# EasyEDA Pro project ProPrj_HTC_Controller.epro

# Schematic HTC_Controller
Board Name: Board1; Create Date: 2024-06-29; Page Name: P1; Project Name: HTC_Controller; Schematic Name: HTC_Controller; Update Date: 2025-04-29; Drawed: 松鼠; Page Size: A4; Version: V1.0
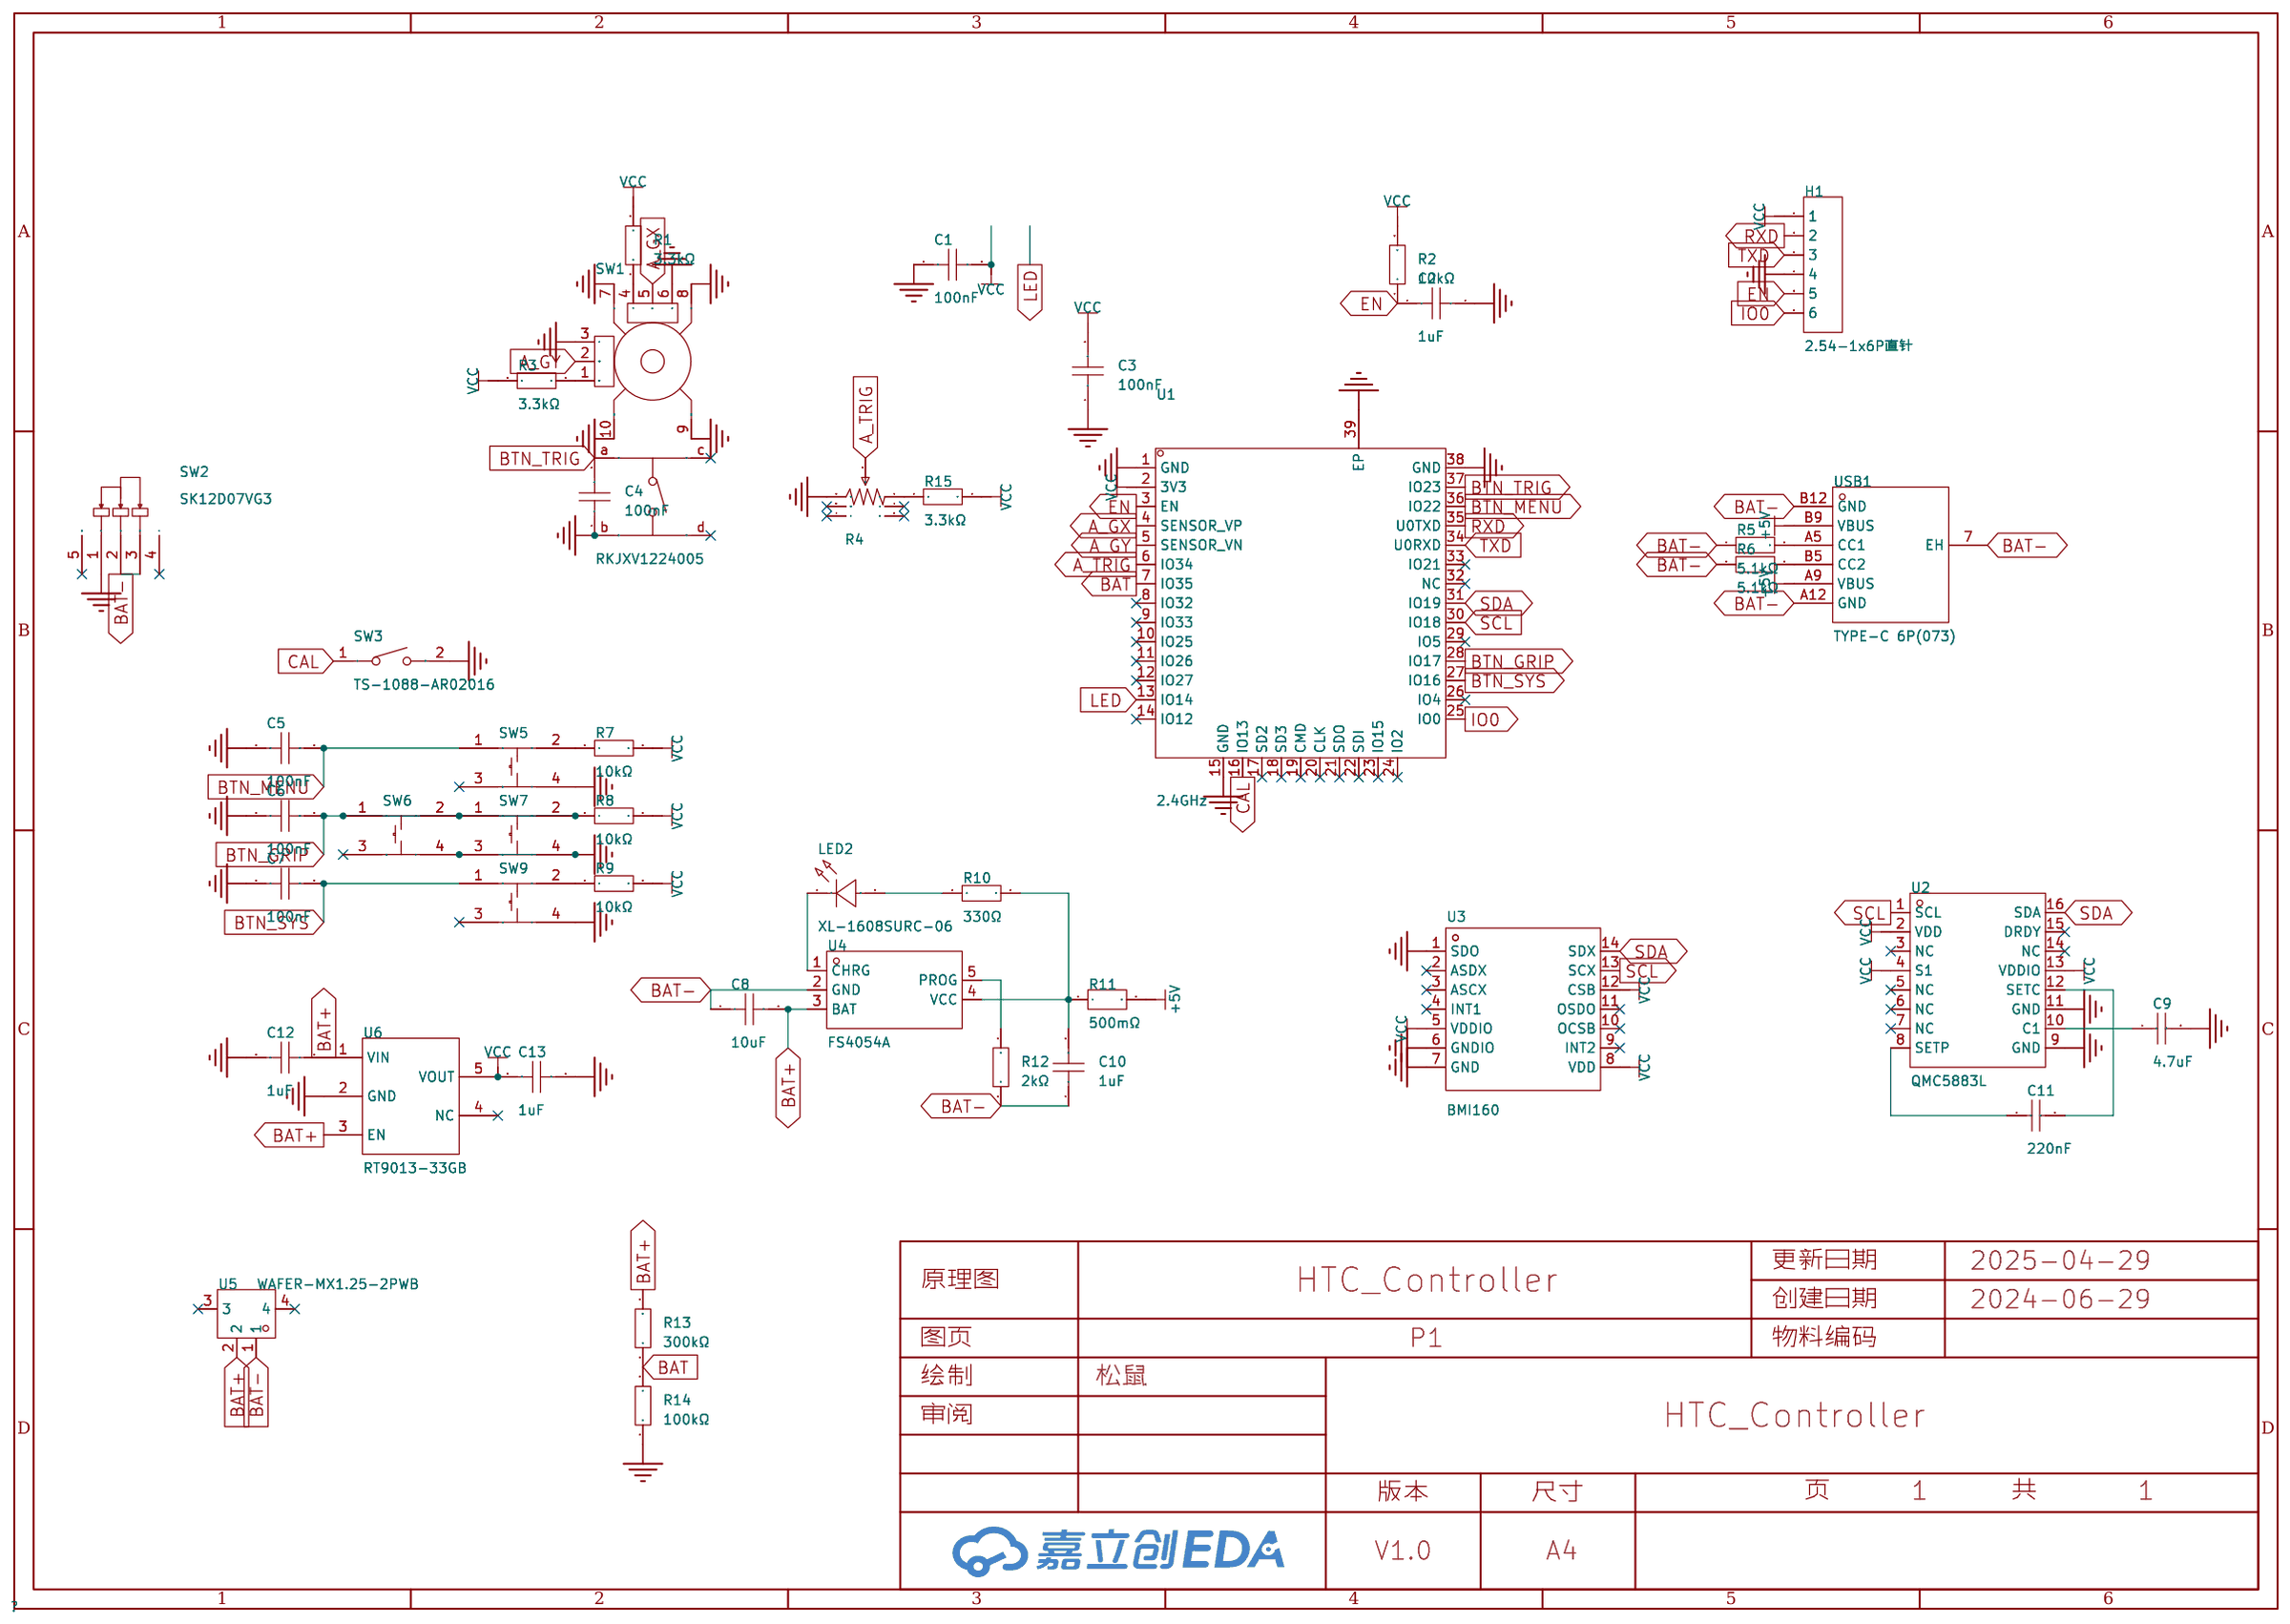
[diagram p0: schematic sheet]

## Parts
C1  100nF  [C0603]
C2  1uF  [C0603]
C3  100nF  [C0603]
C4  100nF  [C0603]
C5  100nF  [C0603]
C6  100nF  [C0603]
C7  100nF  [C0603]
C8  10uF  [C0603]
C9  4.7uF  [C0603]
C10  1uF  [C0603]
C11  220nF  [C0603]
C12  1uF  [C0603]
C13  1uF  [C0603]
H1  2.54-1x6P直针  [HDR-TH_6P-P2.54-V-M-1]
LED2  XL-1608SURC-06  [LED0603-RD_RED]
R1  3.3kΩ  [R0603]
R2  10kΩ  [R0603]
R3  3.3kΩ  [R0603]
R4  Y16-YZL7.2-B5Kb(55)-G-C01  [RES-ADJ-TH_Y16-YZL7.2-B5KB55-G-C01]
R5  5.1kΩ  [R0603]
R6  5.1kΩ  [R0603]
R7  10kΩ  [R0603]
R8  10kΩ  [R0603]
R9  10kΩ  [R0603]
R10  330Ω  [R0603]
R11  500mΩ  [R1210]
R12  2kΩ  [R0603]
R13  300kΩ  [R0603]
R14  100kΩ  [R0603]
R15  3.3kΩ  [R0603]
SW1  RKJXV1224005  [SW-TH_RKJXV1224005]
SW2  SK12D07VG3  [SW-TH_SK12D07VG3]
SW3  TS-1088-AR02016  [SW-SMD_L3.9-W3.0-P4.45]
SW5  TS-1003S-05026  [KEY-SMD_4P-L12.0-W12.0-P5.00-LS15.2]
SW6  TS-1003S-05026  [KEY-SMD_4P-L12.0-W12.0-P5.00-LS15.2]
SW7  TS-1003S-05026  [KEY-SMD_4P-L12.0-W12.0-P5.00-LS15.2]
SW9  TS-1003S-05026  [KEY-SMD_4P-L12.0-W12.0-P5.00-LS15.2]
U1  2.4GHz  [WIRELM-SMD_ESP32-S]
U2  QMC5883L  [LGA-16_L3.0-W3.0-P0.50-BL_SQ]
U3  BMI160  [LGA-14_L3.0-W2.5-P0.50-BL]
U4  FS4054A  [SOT-23-5_L2.9-W1.6-P0.95-LS2.8-BL]
U5  WAFER-MX1.25-2PWB  [CONN-SMD_2P-P1.25_XUNPU_WAFER-MX1.25-2PWB]
U6  RT9013-33GB  [SOT-23-5_L3.0-W1.7-P0.95-LS2.8-BL]
USB1  TYPE-C 6P(073)  [TYPE-C-SMD_TYPE-C-6P_5]

## Library data of the parts
C1 C3-C7 = CC0603KRX7R9BB104: 容值:100nF;精度:±10%;额定电压:50V;材质(温度系数):X7R;; LCSC Part Name: 100nF ±10% 50V; Supplier Part: C14663; Manufacturer: YAGEO(国巨); Supplier Footprint: 0603; JLCPCB Part Class: 基础库; Datasheet: https://atta.szlcsc.com/upload/public/pdf/source/20170116/1484561234239.pdf; Supplier: LCSC; Tolerance: ±10%; Voltage Rated: 50V; Temperature Coefficient: X7R
C2 = CL10A105KB8NNNC: 容值:1uF;精度:±10%;额定电压:50V;材质(温度系数):X5R;; LCSC Part Name: 1uF ±10% 50V; Supplier Part: C15849; Manufacturer: SAMSUNG(三星); Supplier Footprint: 0603; JLCPCB Part Class: 基础库; Datasheet: https://atta.szlcsc.com/upload/public/pdf/source/20160218/1457707763339.pdf; Supplier: LCSC; Tolerance: ±10%; Voltage Rated: 50V; Temperature Coefficient: X5R
C8 = CGA0603X5R106K100JT: 容值:10uF;精度:±10%;额定电压:10V;材质(温度系数):X5R;; LCSC Part Name: 10uF ±10% 10V; Supplier Part: C6119842; Manufacturer: HRE(芯声); Supplier Footprint: 0603; JLCPCB Part Class: 扩展库; Supplier: LCSC; Tolerance: ±10%; Voltage Rated: 10V; Temperature Coefficient: X5R
C9 = CL10A475KO8NNNC: 容值:4.7uF;精度:±10%;额定电压:16V;材质(温度系数):X5R;; LCSC Part Name: 4.7uF ±10% 16V; Supplier Part: C19666; Manufacturer: SAMSUNG(三星); Supplier Footprint: 0603; JLCPCB Part Class: 基础库; Datasheet: https://atta.szlcsc.com/upload/public/pdf/source/20160218/1457707763339.pdf; Supplier: LCSC; Tolerance: ±10%; Voltage Rated: 16V; Temperature Coefficient: X5R
C10 = CGA0603X5R105K160JT: 容值:1uF;精度:±10%;额定电压:16V;材质(温度系数):X5R;; LCSC Part Name: 1uF ±10% 16V; Supplier Part: C6119849; Manufacturer: HRE(芯声); Supplier Footprint: 0603; JLCPCB Part Class: 扩展库; Supplier: LCSC; Tolerance: ±10%; Voltage Rated: 16V; Temperature Coefficient: X5R
C11 = CL10B224KA8NNNC: 容值:220nF;精度:±10%;额定电压:25V;材质(温度系数):X7R;; LCSC Part Name: 220nF ±10% 25V; Supplier Part: C21120; Manufacturer: SAMSUNG(三星); Supplier Footprint: 0603; JLCPCB Part Class: 基础库; Datasheet: https://atta.szlcsc.com/upload/public/pdf/source/20160218/1457707763339.pdf; Supplier: LCSC; Tolerance: ±10%; Voltage Rated: 25V; Temperature Coefficient: X7R
C12 C13 = CGA0603X5R105K500JT: 容值:1uF;精度:±10%;额定电压:50V;温度系数:X5R;; LCSC Part Name: 1uF ±10% 50V; Supplier Part: C6119852; Manufacturer: HRE(芯声); Supplier Footprint: 0603; JLCPCB Part Class: 扩展库; Supplier: LCSC; Tolerance: ±10%; Voltage Rating: 50V; Temperature Coefficient: X5R
H1 = 2.54-1x6P直针: 插针结构:1x6P;间距:2.54mm;行距:-;圆针/方针:方针;安装方式:直插;排数:单排;总PIN位数:6P;额定电流:3A;额定电压:-;配合针长度:-;塑高:-;触头材质:黄铜;触头镀层:-;工作温度:-40℃~+105℃;颜色:黑色;; LCSC Part Name: 1x6P 间距:2.54mm 方针 直插; Supplier Part: C37208; Manufacturer: BOOMELE(博穆精密); Supplier Footprint: 插件,P=2.54mm; JLCPCB Part Class: 扩展库; Datasheet: https://atta.szlcsc.com/upload/public/pdf/source/20250115/42A019761A40C8B839643401D8CA5A96.pdf; Supplier: LCSC; Pin Structure: 1x6P; Pitch: 2.54mm; Circluar Pins/Square Pins: 方针; Mounting Type: 直插; Number of Rows: 单排; Number of Pins: 6P; Current Rating: 3A; Contact Material: 黄铜; Operating Temperature: -40℃~+105℃; Color: 黑色
LED2 = XL-1608SURC-06: 发光颜色:红色;功率:55mW;正向电流:25mA;主波长:617nm~621nm;透镜颜色:无色透明透镜;色温:-;发光角度:120°;载带方式:正贴;工作温度:-30℃~+85℃;; Supplier Part: C965799; Manufacturer: XINGLIGHT(成兴光); Supplier Footprint: 0603; JLCPCB Part Class: 扩展库; Datasheet: https://atta.szlcsc.com/upload/public/pdf/source/20221102/D860AFDD1CDB02C5A8064103A32707E2.pdf; Supplier: LCSC; Emitted Color: 红色; Power Dissipation: 55mW; Forward Current: 25mA; Dominant Wavelength: 617nm~621nm; Peak Wavelength: 623nm; Lens Color: 无色透明透镜; Viewing Angle: 120°; Mounting Sytle: 正贴; Operating Temperature: -30℃~+85℃
R1 R3 R15 = 0603WAF3301T5E: 电阻类型:厚膜电阻;阻值:3.3kΩ;精度:±1%;功率:100mW;最大工作电压:75V;温度系数:±100ppm/℃;; LCSC Part Name: 3.3kΩ ±1% 100mW 厚膜电阻; Supplier Part: C22978; Manufacturer: UNI-ROYAL(厚声); Supplier Footprint: 0603; JLCPCB Part Class: 基础库; Datasheet: https://atta.szlcsc.com/upload/public/pdf/source/20200306/C422600_1E6D84923E4A46A82E41ADD87F860B5C.pdf; Supplier: LCSC; Type: 厚膜电阻; Tolerance: ±1%; Power(Watts): 100mW; Overload Voltage (Max): 75V; Temperature Coefficient: ±100ppm/℃; Operating Temperature Range: -55℃~+155℃
R2 R7-R9 = 0603WAF1002T5E: 电阻类型:厚膜电阻;阻值:10kΩ;精度:±1%;功率:100mW;最大工作电压:75V;温度系数:±100ppm/℃;; LCSC Part Name: 厚膜电阻 10kΩ ±1% 100mW; Supplier Part: C25804; Manufacturer: UNI-ROYAL(厚声); Supplier Footprint: 0603; JLCPCB Part Class: 基础库; Datasheet: https://atta.szlcsc.com/upload/public/pdf/source/20200306/C422600_1E6D84923E4A46A82E41ADD87F860B5C.pdf; Supplier: LCSC; Type: 厚膜电阻; Tolerance: ±1%; Power(Watts): 100mW; Overload Voltage (Max): 75V; Temperature Coefficient: ±100ppm/℃; Operating Temperature Range: -55℃~+155℃
R4 = Y16-YZL7.2-B5Kb(55)-G-C01: 摇杆电位器、操纵杆电位器，适用于航模玩具遥控器电位器、3D摇杆PS4手柄游戏机、无人机摇杆电位器、VR摇杆电位器、工业控制器; Supplier Part: C37323743; Manufacturer: YTL(亚特联); Supplier Footprint: 插件-7P,19.8x15.5mm; JLCPCB Part Class: 扩展库; Datasheet: https://atta.szlcsc.com/upload/public/pdf/source/20240806/CE5C57122514D828D960FC3B4F94AB1F.pdf; Supplier: LCSC
R5 R6 = 0603WAF5101T5E: 电阻类型:厚膜电阻;阻值:5.1kΩ;精度:±1%;功率:100mW;最大工作电压:75V;温度系数:±100ppm/℃;; LCSC Part Name: 5.1kΩ ±1% 100mW 厚膜电阻; Supplier Part: C23186; Manufacturer: UNI-ROYAL(厚声); Supplier Footprint: 0603; JLCPCB Part Class: 基础库; Datasheet: https://atta.szlcsc.com/upload/public/pdf/source/20200306/C422600_1E6D84923E4A46A82E41ADD87F860B5C.pdf; Supplier: LCSC; Type: 厚膜电阻; Tolerance: ±1%; Power(Watts): 100mW; Overload Voltage (Max): 75V; Temperature Coefficient: ±100ppm/℃; Operating Temperature Range: -55℃~+155℃
R10 = 0603WAF3300T5E: 电阻类型:厚膜电阻;阻值:330Ω;精度:±1%;功率:100mW;最大工作电压:75V;温度系数:±100ppm/℃;; LCSC Part Name: 330Ω ±1% 100mW 厚膜电阻; Supplier Part: C23138; Manufacturer: UNI-ROYAL(厚声); Supplier Footprint: 0603; JLCPCB Part Class: 基础库; Datasheet: https://atta.szlcsc.com/upload/public/pdf/source/20200306/C422600_1E6D84923E4A46A82E41ADD87F860B5C.pdf; Supplier: LCSC; Type: 厚膜电阻; Tolerance: ±1%; Power(Watts): 100mW; Overload Voltage (Max): 75V; Temperature Coefficient: ±100ppm/℃; Operating Temperature Range: -55℃~+155℃
R11 = FRL1210FR500TS: 电阻类型:厚膜电阻;阻值:500mΩ;精度:±1%;功率:500mW;最大工作电压:500V;温度系数:±200ppm/℃;; LCSC Part Name: 厚膜电阻 500mΩ ±1% 500mW; Supplier Part: C2960668; Manufacturer: FOJAN(富捷); Supplier Footprint: 1210; JLCPCB Part Class: 扩展库; Datasheet: https://atta.szlcsc.com/upload/public/pdf/source/20211221/925EC7D7225764EE0046F22065062C87.pdf; Supplier: LCSC; Type: 厚膜电阻; Tolerance: ±1%; Power(Watts): 500mW; Overload Voltage (Max): 500V; Temperature Coefficient: ±200ppm/℃; Operating Temperature Range: -55℃~+155℃
R12 = 0603WAF2001T5E: 电阻类型:厚膜电阻;阻值:2kΩ;精度:±1%;功率:100mW;最大工作电压:75V;温度系数:±100ppm/℃;; LCSC Part Name: 2kΩ ±1% 100mW 厚膜电阻; Supplier Part: C22975; Manufacturer: UNI-ROYAL(厚声); Supplier Footprint: 0603; JLCPCB Part Class: 基础库; Datasheet: https://atta.szlcsc.com/upload/public/pdf/source/20200306/C422600_1E6D84923E4A46A82E41ADD87F860B5C.pdf; Supplier: LCSC; Type: 厚膜电阻; Tolerance: ±1%; Power(Watts): 100mW; Overload Voltage (Max): 75V; Temperature Coefficient: ±100ppm/℃; Operating Temperature Range: -55℃~+155℃
R13 = 0603WAF3003T5E: 电阻类型:厚膜电阻;阻值:300kΩ;精度:±1%;功率:100mW;最大工作电压:75V;温度系数:±100ppm/℃;; LCSC Part Name: 300kΩ ±1% 100mW 厚膜电阻; Supplier Part: C23024; Manufacturer: UNI-ROYAL(厚声); Supplier Footprint: 0603; JLCPCB Part Class: 基础库; Datasheet: https://atta.szlcsc.com/upload/public/pdf/source/20200306/C422600_1E6D84923E4A46A82E41ADD87F860B5C.pdf; Supplier: LCSC; Type: 厚膜电阻; Tolerance: ±1%; Power(Watts): 100mW; Overload Voltage (Max): 75V; Temperature Coefficient: ±100ppm/℃; Operating Temperature Range: -55℃~+155℃
R14 = 0603WAF1003T5E: 电阻类型:厚膜电阻;阻值:100kΩ;精度:±1%;功率:100mW;最大工作电压:75V;温度系数:±100ppm/℃;; LCSC Part Name: 100kΩ ±1% 100mW 厚膜电阻; Supplier Part: C25803; Manufacturer: UNI-ROYAL(厚声); Supplier Footprint: 0603; JLCPCB Part Class: Basic Part; Datasheet: https://atta.szlcsc.com/upload/public/pdf/source/20200306/C422600_1E6D84923E4A46A82E41ADD87F860B5C.pdf; Supplier: LCSC; Type: 厚膜电阻; Tolerance: ±1%; Power(Watts): 100mW; Overload Voltage (Max): 75V; Temperature Coefficient: ±100ppm/℃; Operating Temperature Range: -55℃~+155℃
SW1 = RKJXV1224005: 操纵杆复位 中央按动开关 适用于航模玩具遥控器电位器、3D摇杆PS4手柄游戏机、无人机摇杆电位器、工业控制器; Supplier Part: C146170; Manufacturer: ALPSALPINE(阿尔卑斯阿尔派); Supplier Footprint: 插件,13x13mm; JLCPCB Part Class: 扩展库; Datasheet: https://atta.szlcsc.com/upload/public/pdf/source/20180125/C146170_15168615510911301620.pdf; Supplier: LCSC
SW2 = SK12D07VG3: 电路结构:单刀双掷;安装方式:侧插;开关颜色:-;额定电流(DC):500mA;额定电压(DC):50V;额定电流(AC):-;额定电压(AC):-;机械寿命:5千次;; LCSC Part Name: 两档位卧式拨动开关,柄长3MM; Supplier Part: C431547; Manufacturer: SHOU HAN(首韩); Supplier Footprint: 插件; JLCPCB Part Class: 扩展库; Datasheet: https://atta.szlcsc.com/upload/public/pdf/source/20190925/C431547_01B93C6F3FA5C09E15F8CCBF4E6DB91A.pdf; Supplier: LCSC; Circuit: 单刀双掷; Pin Style: PC引脚; Switch Length: 8.7mm; Switch Width: 4.4mm; Switch Height: 4.7mm; Mounting Style: 侧插; Current Rating (DC): 500mA; Voltage Rating (DC): 50V; Mechanical Life: 5千次; Operating Temperature: -10℃~+50℃
SW3 = TS-1088-AR02016: 电路结构:单刀单掷;按钮形状:圆形按钮;作用力:160gf;安装方式:立贴;开关长度:4mm;开关宽度:3mm;开关高度:2mm;带支架:不带;触点电流:50mA;额定电压(DC):12V;绝缘电阻:100MΩ;机械寿命:10万次;; LCSC Part Name: 4*3*2mm 立贴 轻触开关; Supplier Part: C720477; Manufacturer: XUNPU(讯普); Supplier Footprint: SMD; JLCPCB Part Class: 扩展库; Datasheet: https://atta.szlcsc.com/upload/public/pdf/source/20200810/C720475_60D09DD6C54279ADDB2DC25100F1CC11.pdf; Supplier: LCSC; Circuit: 单刀单掷; Actuator Style: 圆形按钮; Operating Force: 160gf; Mounting Style: 立贴; Switch Length: 4mm; Switch Width: 3mm; Switch Height: 2mm; Strike Gundam: 不带; Contact Current: 50mA; Voltage Rating (DC): 12V; Insulation Resistance: 100MΩ; Actuator/Cap Color: 黑色; Pin Style: SMD接片; Mechanical Life: 10万次; Operating Temperature: -30℃~+80℃
SW5-SW7 SW9 = TS-1003S-05026: 电路结构:单刀单掷;按钮形状:圆形按钮;安装方式:立贴;开关长度:12mm;开关宽度:12mm;开关高度:5mm;触点电流:50mA;额定电压(DC):12V;带灯:-;机械寿命:-;; LCSC Part Name: 12*12*5mm 立贴 轻触开关; Supplier Part: C455219; Manufacturer: XUNPU(讯普); Supplier Footprint: SMD,12x12mm; JLCPCB Part Class: 扩展库; Datasheet: https://atta.szlcsc.com/upload/public/pdf/source/20191118/C455233_8350A2262BDF54A6D5D6E1D36705B166.pdf; Supplier: LCSC; Circuit: 单刀单掷; Actuator Style: 圆形按钮; Mounting Style: 立贴; Switch Length: 12mm; Switch Width: 12mm; Switch Height: 5mm; Contact Current: 50mA; Voltage Rating (DC): 12V
U1 = ESP32-S: 核心处理器:ESP32芯片;频率:2.4GHz;天线形式:IPEX接口;发射功率:17dBm;接收灵敏度:-90dBm;; Supplier Part: C277944; Manufacturer: Ai-Thinker(安信可); Supplier Footprint: SMD; JLCPCB Part Class: 扩展库; Datasheet: https://atta.szlcsc.com/upload/public/pdf/source/20211217/F4BEA33E732D6002D10DAED85BBCB52B.pdf; Supplier: LCSC; Core Processor: ESP32芯片; Support Interface: I2C；UART；DAC；SPI；PWM；ADC; Antenna Type: IPEX接口; Output Power: 17dBm; Operating Voltage: 3.3V; Sensitivity: -90dBm; Operating Temperature: -40℃~+85℃
U2 = QMC5883L: LCSC Part Name: 三轴磁传感器; Supplier Part: C976032; Manufacturer: QST(上海矽睿); Supplier Footprint: LGA-16(3x3); JLCPCB Part Class: 扩展库; Datasheet: https://atta.szlcsc.com/upload/public/pdf/source/20201217/C976032_5B9A2F3901E175046CBA037B1F18A1F2.pdf; Supplier: LCSC
U3 = BMI160: 传感器类型:-;轴向:-;接口类型:-;; Supplier Part: C94021; Manufacturer: Bosch(博世); Supplier Footprint: LGA-14(2.5x3); JLCPCB Part Class: 扩展库; Datasheet: https://atta.szlcsc.com/upload/public/pdf/source/20170818/C94021_1503051343757895423.pdf; Supplier: LCSC; Operating Temperature: -40℃~+85℃
U4 = FS4054A: LCSC Part Name: 电池管理; Supplier Part: C2936840; Manufacturer: FOSAN(富信); Supplier Footprint: SOT-23-5L; JLCPCB Part Class: 扩展库; Datasheet: https://atta.szlcsc.com/upload/public/pdf/source/20211228/BC9C32D45588DB82BD95EABB7A26746D.pdf; Supplier: LCSC
U5 = WAFER-MX1.25-2PWB: 插针结构:1x2P;间距:1.25mm;安装方式:卧贴;总PIN数:2P;排数:1;每排PIN数:2;额定电流:1A;工作温度范围:-25℃~+85℃;; LCSC Part Name: 1x2P 间距:1.25mm 卧贴; Supplier Part: C3029359; Manufacturer: XUNPU(讯普); Supplier Footprint: SMD,P=1.25mm,卧贴; JLCPCB Part Class: 扩展库; Datasheet: https://atta.szlcsc.com/upload/public/pdf/source/20220527/5ACBB683E384B6AD06743F272F933620.pdf; Supplier: LCSC; Pins Structure: 1x2P; Pitch: 1.25mm; Mounting Style: 卧贴; Number of Pins: 2P; Number of Rows: 1; Number of PINs Per Row: 2; Current Rating (Max): 1A; Operating Temperature Range: -25℃~+85℃
U6 = RT9013-33GB: 输出类型:固定;最大输入电压:5.5V;输出电压:3.3V;输出电流:500mA;电源纹波抑制比(PSRR):50dB@(10kHz);输出极性:正极;; LCSC Part Name: 输入5.5V 输出3.3V 500mA; Supplier Part: C47773; Manufacturer: RICHTEK(立锜); Supplier Footprint: SOT-23-5; JLCPCB Part Class: 扩展库; Datasheet: https://atta.szlcsc.com/upload/public/pdf/source/20150504/1457707282459.pdf; Supplier: LCSC; Output Type: 固定; Maximum Input Voltage: 5.5V; Output Voltage: 3.3V; Output Current: 500mA; Power Supply Rejection Ratio (PSRR): 50dB@(10kHz); Dropout Voltage: 400mV@(500mA); standby current: 50uA; Feature: 低ESR；防静电保护；热保护(TSD)；过流保护(OCP)；带使能; Operating Temperature: -40℃~+85℃; Output Polarity: 正极; Number of Outputs: 1
USB1 = TYPE-C 6P(073): 连接器类型:Type-C;标准:USB 3.1;公母:母;安装方式:卧贴;触点数量:6P;端口数量:1;额定电流 - 电源:3A;工作温度范围:-25℃~+85℃;; LCSC Part Name: Type-C 母 卧贴; Supplier Part: C668623; Manufacturer: SHOU HAN(首韩); Supplier Footprint: SMD; JLCPCB Part Class: 扩展库; Datasheet: https://atta.szlcsc.com/upload/public/pdf/source/20200618/C668623_A4B260DED7AC1949BAC6AE39E9F4CD80.pdf; Supplier: LCSC; Connector Type: Type-C; Standard: USB 3.1; Gender: 母; Mounting Style: 卧贴; Number of Contacts: 6P; Number of Ports: 1; Current Rating - Power (Max): 3A; Operating Temperature Range: -25℃~+85℃; Rated Voltage (Max): 5V; Connect-Disconnect Life: 1万次; Core Colour: 黑色

## Nets
+5V: R11.2 USB1.A9(VBUS) USB1.B9(VBUS)
GND: C1.1 C2.2 C3.1 C4.1 C5.1 C6.1 C7.1 C9.2 C12.2 C13.1 H1.4 R4.3 R14.1 SW1.3(A) SW1.6(B) SW1.7(GND) SW1.8(GND) SW1.9(GND) SW1.10(GND) SW1.b SW2.1 SW3.2 SW5.4 SW6.4 SW7.3 SW7.4 SW9.4 U1.1(GND) U1.15(GND) U1.38(GND) U1.39(EP) U2.9(GND) U2.11(GND) U3.1(SDO) U3.6(GNDIO) U3.7(GND) U6.2(GND)
VCC: C1.2 C3.2 C13.2 H1.1 R1.2 R2.2 R3.1 R7.2 R8.2 R9.2 R15.2 U1.2(3V3) U2.2(VDD) U2.4(S1) U2.13(VDDIO) U3.5(VDDIO) U3.8(VDD) U3.12(CSB) U6.5(VOUT)
A_GX: SW1.5(DTA) U1.4(SENSOR_VP)
A_GY: SW1.2(DTA) U1.5(SENSOR_VN)
A_TRIG: R4.2 U1.6(IO34)
BAT: R13.1 R14.2 U1.7(IO35)
BAT+: C8.2 C12.1 R13.2 U4.3(BAT) U5.2 U6.1(VIN) U6.3(EN)
BAT-: C8.1 C10.1 R5.1 R6.1 R12.2 SW2.2 SW2.3 U4.2(GND) U5.1 USB1.7(EH) USB1.A12(GND) USB1.B12(GND)
BTN_GRIP: C6.2 R8.1 SW6.1 SW6.2 SW7.1 SW7.2 U1.28(IO17)
BTN_MENU: C5.2 SW5.1 U1.36(IO22)
BTN_SYS: C7.2 SW9.1 U1.27(IO16)
BTN_TRIG: C4.2 SW1.a U1.37(IO23)
CAL: SW3.1 U1.16(IO13)
EN: C2.1 H1.5 R2.1 U1.3(EN)
IO0: H1.6 U1.25(IO0)
LED: U1.13(IO14)
RXD: H1.2 U1.35(U0TXD)
SCL: U1.30(IO18) U2.1(SCL) U3.13(SCX)
SDA: U1.31(IO19) U2.16(SDA) U3.14(SDX)
TXD: H1.3 U1.34(U0RXD)
$1N14743: LED2.2(A) R10.2
$1N14744: LED2.1(K) U4.1(CHRG)
$1N14746: R12.1 U4.5(PROG)
$1N14747: C10.2 R10.1 R11.1 U4.4(VCC)
$1N15140: C11.2 U2.12(SETC)
$1N15141: C11.1 U2.8(SETP)
$1N15144: C9.1 U2.10(C1)
$1N15837: R6.2 USB1.B5(CC2)
$1N15838: R5.2 USB1.A5(CC1)
$1N20609: R3.2 SW1.1(B)
$1N20611: R1.1 SW1.4(A)
$1N24568: R9.1 SW9.2
$1N24570: R7.1 SW5.2
$1N30109: R4.1 R15.1

Not connected (* = marked no-connect by the designer): R4 4* 5* 6* 7*; SW1 c* d*; SW2 4* 5*; SW5 3*; SW6 3*; SW9 3*; U1 8(IO32)* 9(IO33)* 10(IO25)* 11(IO26)* 12(IO27)* 14(IO12)* 17(SD2)* 18(SD3)* 19(CMD)* 20(CLK)* 21(SDO)* 22(SDI)* 23(IO15)* 24(IO2)* 26(IO4)* 29(IO5)* 32(NC)* 33(IO21)*; U2 3(NC)* 5(NC)* 6(NC)* 7(NC)* 14(NC)* 15(DRDY)*; U3 2(ASDX)* 3(ASCX)* 4(INT1)* 9(INT2)* 10(OCSB)* 11(OSDO)*; U5 3* 4*; U6 4(NC)*

# Schematic HTC_Controller_1
Board Name: Board1_1; Create Date: 2025-04-28; Page Name: P1; Project Name: HTC_Controller; Schematic Name: HTC_Controller_1; Update Date: 2025-04-28; Drawed: 松鼠; Page Size: A4; Version: V1.0
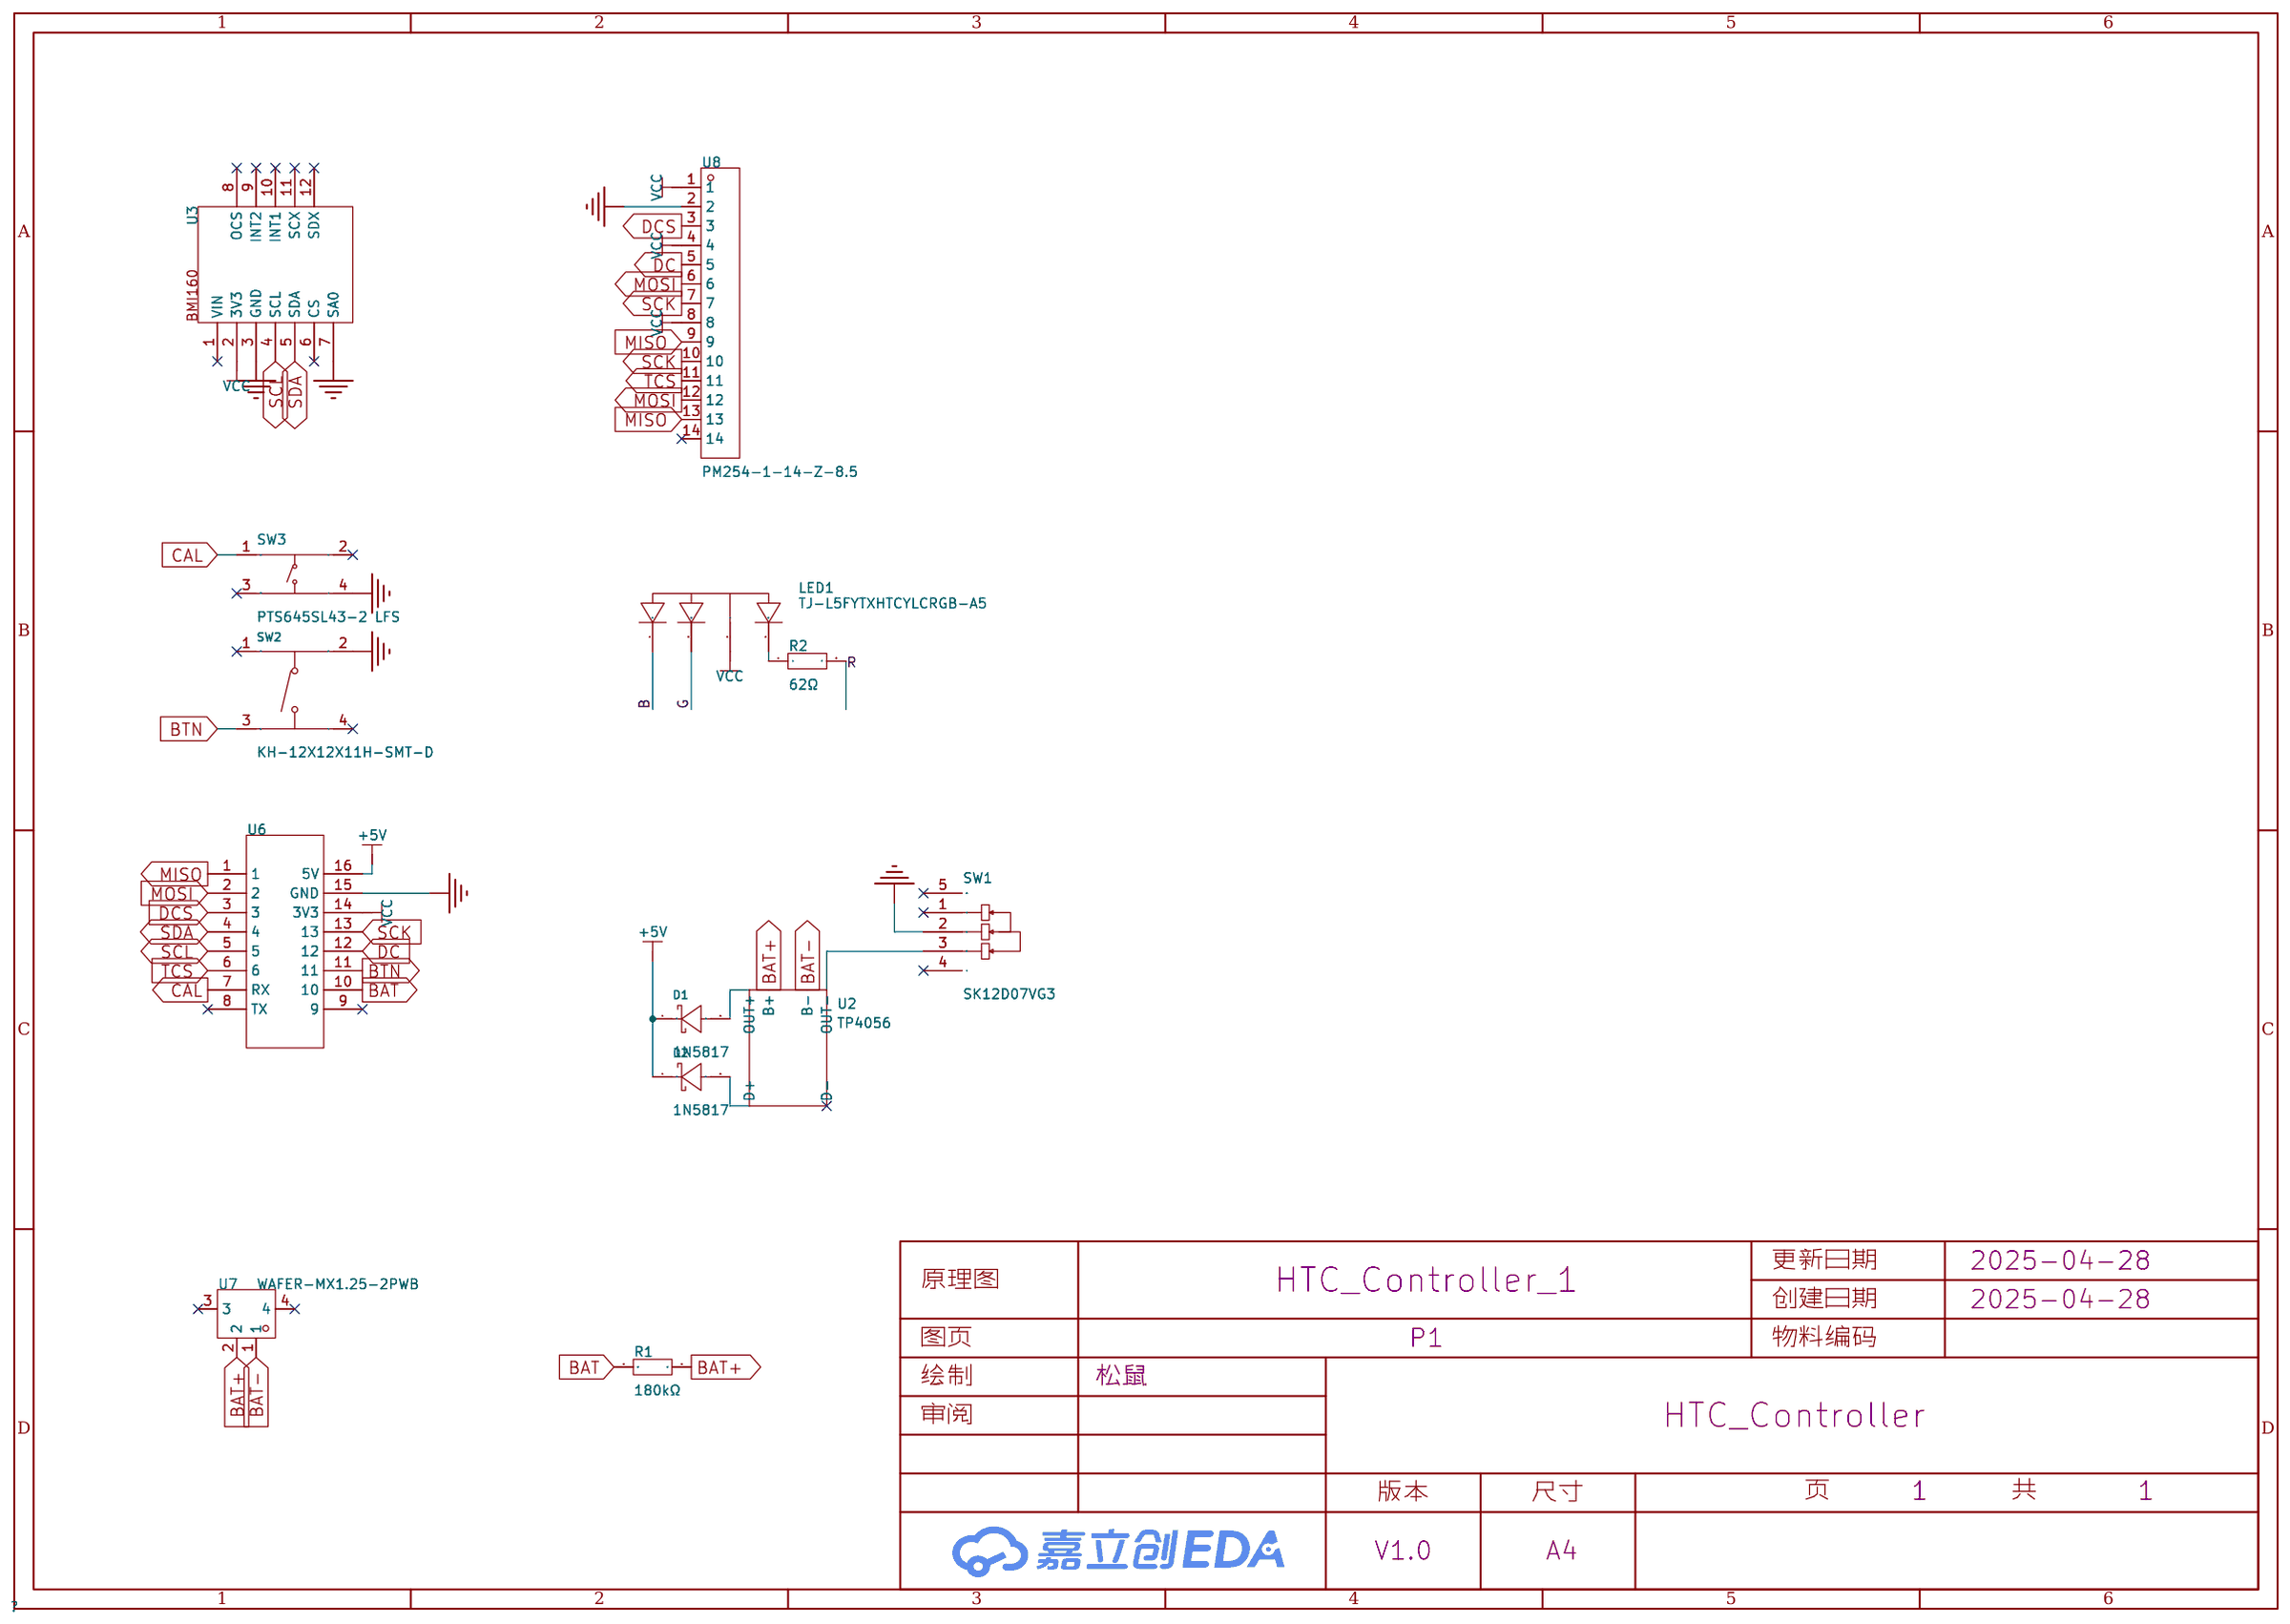
[diagram p1: schematic sheet]

## Parts
D1  1N5817  [DO-41_BD2.4-L4.7-P8.70-D0.9-RD]
D2  1N5817  [DO-41_BD2.4-L4.7-P8.70-D0.9-RD]
LED1  TJ-L5FYTXHTCYLCRGB-A5  [LED-TH_4P-BD5.8-P1.30]
R1  180kΩ  [RES-TH_BD2.2-L6.5-P10.50-D0.6]
R2  62Ω  [RES-TH_BD2.2-L6.5-P10.50-D0.6]
SW1  SK12D07VG3  [SW-TH_SK12D07VG3]
SW2  KH-12X12X11H-SMT-D  [SW-SMD_4P-L12.0-W12.0-P5.00-LS15.2]
SW3  PTS645SL43-2 LFS  [KEY-TH_4P-L6.0-W6.0-P4.50-LS6.50]
U2  TP4056  [TP4056]
U3  -  [BMI160]
U6  -  [【封装Supermini】]
U7  WAFER-MX1.25-2PWB  [CONN-SMD_2P-P1.25_XUNPU_WAFER-MX1.25-2PWB]
U8  PM254-1-14-Z-8.5  [HDR-TH_14P-P2.54-V-F-1]

## Library data of the parts
D1 D2 = 1N5817_C698892: 正向压降(Vf):450mV@1A;直流反向耐压(Vr):20V;平均整流电流(Io):1A;; LCSC Part Name: 电压:20V 电流:1A; Supplier Part: C698892; Manufacturer: YANGJIE(扬杰); Supplier Footprint: DO-41; JLCPCB Part Class: 扩展库; Datasheet: https://atta.szlcsc.com/upload/public/pdf/source/20200709/C698892_A0C4401ECD24BAA25A888A704F208514.pdf; Supplier: LCSC; Forward Voltage (Vf@If): 450mV@1A; Reverse Voltage (Vr): 20V; Average Rectified Current (Io): 1A; Reverse Leakage Current (Ir): 100uA@20V
LED1 = TJ-L5FYTXHTCYLCRGB-A5: 5MM圆头三色RGB,直插RGB,三色RGB; LCSC Part Name: RGB三色; Supplier Part: C330749; Manufacturer: TOGIALED(统佳); Supplier Footprint: 插件,D=5mm; JLCPCB Part Class: 扩展库; Datasheet: https://atta.szlcsc.com/upload/public/pdf/source/20181220/C330749_E86DC6F3551A01708A793939DC45E1CA.pdf; Supplier: LCSC
R1 = MFR-25JT-52-180K: 电阻类型:金属膜电阻;阻值:180kΩ;精度:±5%;功率:250mW;; LCSC Part Name: 金属膜电阻 180kΩ ±5% 250mW; Supplier Part: C176462; Manufacturer: YAGEO(国巨); Supplier Footprint: 插件,D2.4xL6.3mm; JLCPCB Part Class: 扩展库; Datasheet: https://atta.szlcsc.com/upload/public/pdf/source/20191118/C457825_18355E864DE4965678DC27B0EBC3E21E.pdf; Supplier: LCSC; Type: 金属膜电阻; Tolerance: ±5%; Power(Watts): 250mW; Operating Temperature Range: -55℃~+155℃
R2 = MF1/4W-62Ω±1% T: 电阻类型:金属膜电阻;阻值:62Ω;精度:±1%;功率:250mW;温度系数:±100ppm/℃;; LCSC Part Name: 62Ω ±1% 250mW 金属膜电阻; Supplier Part: C119299; Manufacturer: CCO(千志电子); Supplier Footprint: 插件,D2.3xL6.5mm; JLCPCB Part Class: 扩展库; Datasheet: https://atta.szlcsc.com/upload/public/pdf/source/20190910/C427326_62A6D058BC0FF74963A2F22379CA06CE.pdf; Supplier: LCSC; Type: 金属膜电阻; Tolerance: ±1%; Overload Voltage (Max): 250V; Power(Watts): 250mW; Temperature Coefficient: ±100ppm/℃; Operating Temperature Range: -55℃~+155℃
SW1 = SK12D07VG3: 电路结构:单刀双掷;安装方式:侧插;开关颜色:-;额定电流(DC):500mA;额定电压(DC):50V;额定电流(AC):-;额定电压(AC):-;机械寿命:5千次;; LCSC Part Name: 两档位卧式拨动开关,柄长3MM; Supplier Part: C431547; Manufacturer: SHOU HAN(首韩); Supplier Footprint: 插件; JLCPCB Part Class: 扩展库; Datasheet: https://atta.szlcsc.com/upload/public/pdf/source/20190925/C431547_01B93C6F3FA5C09E15F8CCBF4E6DB91A.pdf; Supplier: LCSC; Circuit: 单刀双掷; Pin Style: PC引脚; Switch Length: 8.7mm; Switch Width: 4.4mm; Switch Height: 4.7mm; Mounting Style: 侧插; Current Rating (DC): 500mA; Voltage Rating (DC): 50V; Mechanical Life: 5千次; Operating Temperature: -10℃~+50℃
SW2 = KH-12X12X11H-SMT-D: 开关长度:12mm;开关宽度:12mm;开关高度:11mm;; LCSC Part Name: 轻触开关12*12*11 贴片耐高温环保 袋装; Supplier Part: C18186487; Manufacturer: kinghelm(金航标); Supplier Footprint: SMD,12x12mm; JLCPCB Part Class: 扩展库; Datasheet: https://atta.szlcsc.com/upload/public/pdf/source/20230919/DBE6D874A43E00977180E4384D9B0FBF.pdf; Supplier: LCSC; Switch Length: 12mm; Switch Width: 12mm; Switch Height: 11mm
SW3 = PTS645SL43-2 LFS: Supplier Part: C2799146; Supplier Footprint: 插件,6x6x4.3mm; JLCPCB Part Class: 扩展库; Supplier: LCSC
U2 = TP4056
U3 = BMI160
U6 = ESP32 SuperMini
U7 = WAFER-MX1.25-2PWB: 插针结构:1x2P;间距:1.25mm;安装方式:卧贴;总PIN数:2P;排数:1;每排PIN数:2;额定电流:1A;工作温度范围:-25℃~+85℃;; LCSC Part Name: 1x2P 间距:1.25mm 卧贴; Supplier Part: C3029359; Manufacturer: XUNPU(讯普); Supplier Footprint: SMD,P=1.25mm,卧贴; JLCPCB Part Class: 扩展库; Datasheet: https://atta.szlcsc.com/upload/public/pdf/source/20220527/5ACBB683E384B6AD06743F272F933620.pdf; Supplier: LCSC; Pins Structure: 1x2P; Pitch: 1.25mm; Mounting Style: 卧贴; Number of Pins: 2P; Number of Rows: 1; Number of PINs Per Row: 2; Current Rating (Max): 1A; Operating Temperature Range: -25℃~+85℃
U8 = PM254-1-14-Z-8.5: 插孔结构:1x14P;间距:2.54mm;行距:-;圆孔/方孔:方孔;安装类型:直插;排数:单排;总孔位数:14P;额定电流:3A;额定电压:-;插孔方向:顶部;塑高:8.5mm;触头材质:铜合金;工作温度范围:-40℃~+105℃;焊接温度(最大值):260℃@5S;; LCSC Part Name: 1x14P 间距:2.54mm 直插; Supplier Part: C2897377; Manufacturer: HCTL(华灿天禄); Supplier Footprint: 插件,P=2.54mm; JLCPCB Part Class: 扩展库; Datasheet: https://atta.szlcsc.com/upload/public/pdf/source/20230609/534BE42964C679BDE98E061007C4ABD6.pdf; Supplier: LCSC; Holes Structure: 1x14P; Pitch: 2.54mm; Circular Hole / Square Hole: 方孔; Mounting Type: 直插; Number of Rows: 单排; Number of Holes: 14P; Current Rating (Max): 3A; Holes Direction: 顶部; Insulation Height: 8.5mm; Contact Material: 铜合金; Operating Temperature Range: -40℃~+105℃; Soldering Temperature(Max): 260℃@5S

## Nets
+5V: D1.1 D2.1 U6.16(5V)
GND: SW1.2 SW2.2 SW3.4 U3.3(GND) U3.7(SA0) U6.15(GND) U8.2
VCC: LED1.2(+) U3.2(3V3) U6.14(3V3) U8.1 U8.4 U8.8
B: LED1.4
BAT: R1.1 U6.10
BAT+: R1.2 U2.3(B+) U7.2
BAT-: U2.4(B-) U7.1
BTN: SW2.3 U6.11
CAL: SW3.1 U6.7(RX)
DC: U6.12 U8.5
DCS: U6.3 U8.3
G: LED1.3
MISO: U6.1 U8.9 U8.13
MOSI: U6.2 U8.6 U8.12
R: R2.2
SCK: U6.13 U8.7 U8.10
SCL: U3.4(SCL) U6.5
SDA: U3.5(SDA) U6.4
TCS: U6.6 U8.11
$1N976: SW1.3 U2.6(OUT-)
$1N1373: D1.2 U2.5(OUT+)
$1N1387: D2.2 U2.1(D+)
$1N4825: LED1.1 R2.1

Not connected (* = marked no-connect by the designer): SW1 1* 4* 5*; SW2 1* 4*; SW3 2* 3*; U2 2(D-)*; U3 1(VIN)* 6(CS)* 8(OCS)* 9(INT2)* 10(INT1)* 11(SCX)* 12(SDX)*; U6 8(TX)* 9*; U7 3* 4*; U8 14*

# Board PCB1
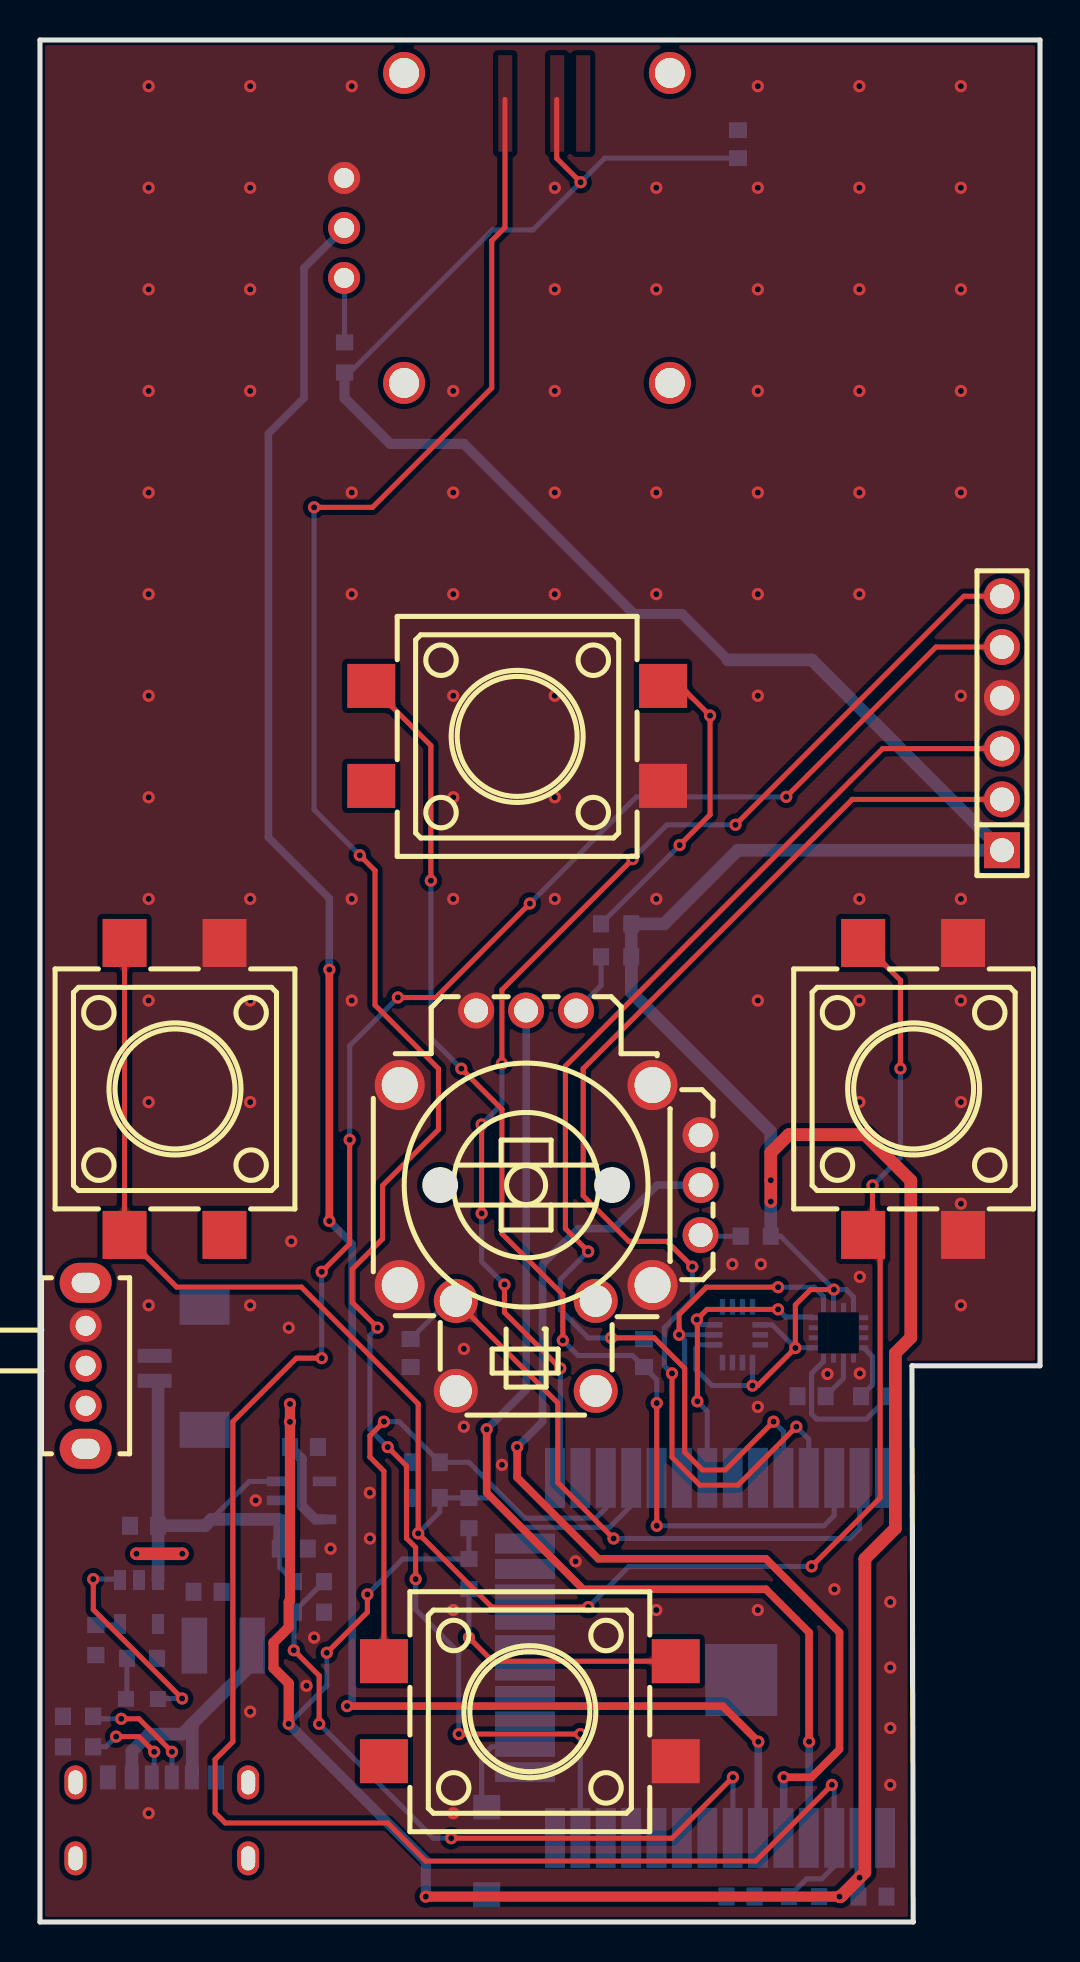
[diagram p2: board, top side]
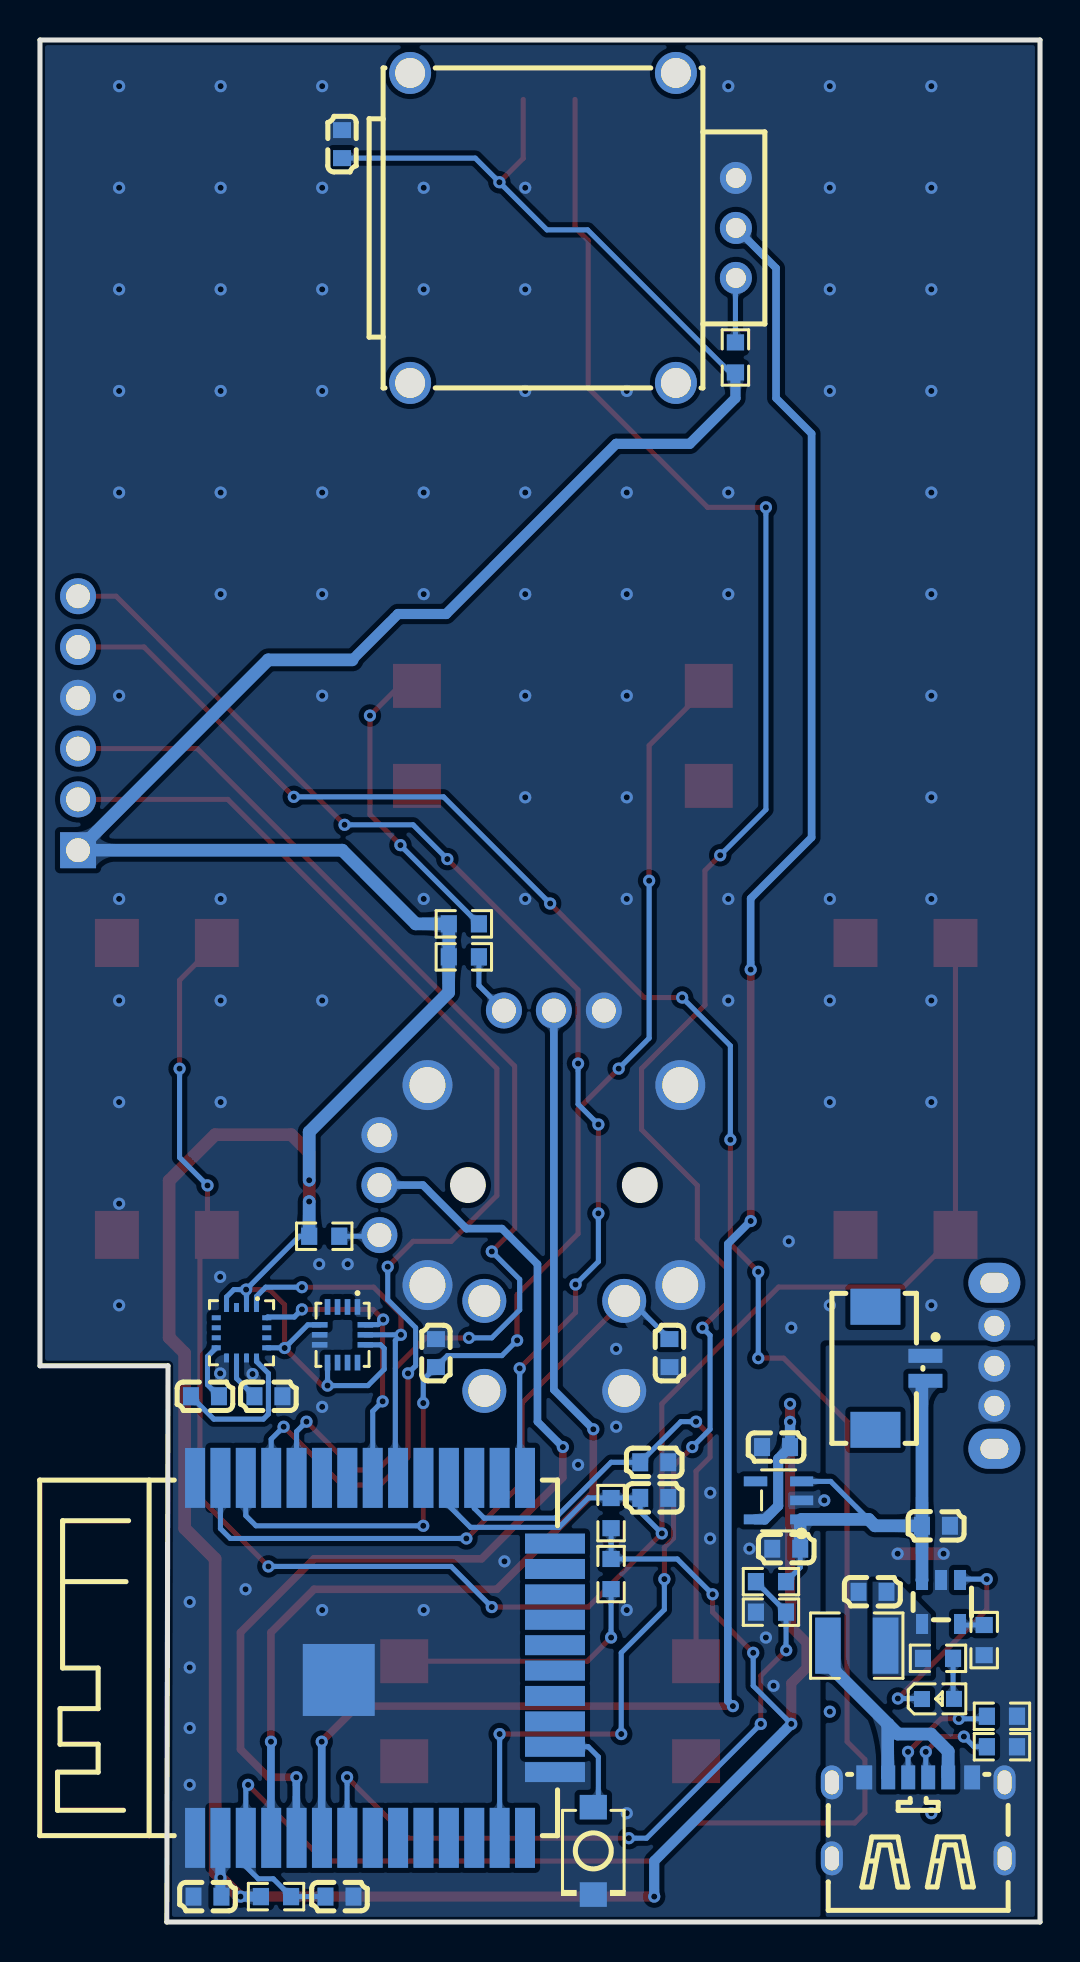
[diagram p3: board, bottom side, seen from below]

Outline 50.04 x 94.11 mm; copper layers: Top Layer, Bottom Layer. Coordinates in mm from the lower left corner of the outline.
Outline path: 0,94.11 0,0 43.69,0 43.63,27.81 50.04,27.81 50.04,94.11 0,94.11
Stack: Top Layer 0.035mm / Dielectric1 1.51mm FR4 er 4.5 / Bottom Layer 0.035mm

## Design rules (mm)
template: 自定义配置
spacing copperThickness1oz: track to track 0.102, other pairs 0.152 to 0.3
spacing copperThickness2oz (default): track to track 0.203, other pairs 0.152 to 0.3
track width copperThickness1oz: min 0.127, default 0.254, max 2.54
track width copperThickness2oz (default): min 0.203, default 0.254, max 2.54
track width 5.6mm: min 0.56, default 0.56, max 0.56
differential pair differentialPair (default): width min 0.127, default 0.254, max 2.54; gap min 0.152, default 0.152
via viaSize (default): diameter min 0.5, default 0.61, max 10; hole min 0.3, default 0.305, max 6.3

## Placement (name value [footprint] x y rotation side)
C1  100nF  [C0603]  34.92 88.9 270 bottom
C2  1uF  [C0603]  35.05 1.27 180 bottom
C3  100nF  [C0603]  41.66 1.27 180 bottom
C4  100nF  [C0603]  18.54 28.45 90 bottom
C5  100nF  [C0603]  30.23 28.45 270 bottom
C6  100nF  [C0603]  19.3 21.21 0 bottom
C7  100nF  [C0603]  19.3 22.99 0 bottom
C8  10uF  [C0603]  5.21 19.81 0 bottom
C9  4.7uF  [C0603]  38.61 26.29 180 bottom
C10  1uF  [C0603]  8.38 16.51 180 bottom
C11  220nF  [C0603]  41.78 26.29 0 bottom
C12  1uF  [C0603]  12.7 18.67 0 bottom
C13  1uF  [C0603]  13.21 23.75 180 bottom
H1  2.54-1x6P直针  [HDR-TH_6P-P2.54-V-M-1]  48.13 59.94 90 top
LED2  XL-1608SURC-06  [LED0603-RD_RED]  5.11 11.15 180 bottom
R1  3.3kΩ  [R0603]  28.83 48.26 0 bottom
R2  10kΩ  [R0603]  38.23 1.27 0 bottom
R3  3.3kΩ  [R0603]  35.81 34.29 180 bottom
R4  Y16-YZL7.2-B5Kb(55)-G-C01  [RES-ADJ-TH_Y16-YZL7.2-B5KB55-G-C01]  23.37 84.71 180 bottom
R5  5.1kΩ  [R0603]  1.91 10.29 0 bottom
R6  5.1kΩ  [R0603]  1.91 8.76 0 bottom
R7  10kΩ  [R0603]  28.83 49.91 0 bottom
R8  10kΩ  [R0603]  21.46 20.45 270 bottom
R9  10kΩ  [R0603]  21.46 17.4 90 bottom
R10  330Ω  [R0603]  5.11 13.18 180 bottom
R11  500mΩ  [R1210]  9.17 13.82 0 bottom
R12  2kΩ  [R0603]  2.79 14.1 270 bottom
R13  300kΩ  [R0603]  13.46 17.02 180 bottom
R14  100kΩ  [R0603]  13.46 15.49 180 bottom
R15  3.3kΩ  [R0603]  15.24 78.23 270 bottom
SW1  RKJXV1224005  [SW-TH_RKJXV1224005]  25.53 36.07 0 top
SW2  SK12D07VG3  [SW-TH_SK12D07VG3]  2.29 27.81 270 top
SW3  TS-1088-AR02016  [SW-SMD_L3.9-W3.0-P4.45]  22.35 3.56 270 bottom
SW5  TS-1003S-05026  [KEY-SMD_4P-L12.0-W12.0-P5.00-LS15.2]  23.88 59.31 0 top
SW6  TS-1003S-05026  [KEY-SMD_4P-L12.0-W12.0-P5.00-LS15.2]  6.73 41.66 90 top
SW7  TS-1003S-05026  [KEY-SMD_4P-L12.0-W12.0-P5.00-LS15.2]  43.69 41.66 90 top
SW9  TS-1003S-05026  [KEY-SMD_4P-L12.0-W12.0-P5.00-LS15.2]  24.51 10.54 0 top
U1  2.4GHz  [WIRELM-SMD_ESP32-S]  33.27 13.21 90 bottom
U2  QMC5883L  [LGA-16_L3.0-W3.0-P0.50-BL_SQ]  39.95 29.46 0 bottom
U3  BMI160  [LGA-14_L3.0-W2.5-P0.50-BL]  34.9 29.36 0 bottom
U4  FS4054A  [SOT-23-5_L2.9-W1.6-P0.95-LS2.8-BL]  4.95 16 0 bottom
U5  WAFER-MX1.25-2PWB  [CONN-SMD_2P-P1.25_XUNPU_WAFER-MX1.25-2PWB]  6.98 27.69 270 bottom
U6  RT9013-33GB  [SOT-23-5_L3.0-W1.7-P0.95-LS2.8-BL]  13.08 21.08 90 bottom
USB1  TYPE-C 6P(073)  [TYPE-C-SMD_TYPE-C-6P_5]  6.1 5.21 180 bottom

## Footprints (pads in the part's own frame, mm; a bottom-side part is the same pattern mirrored in y, then rotated)
C0603
  rect 0.8x0.9 smd: 1(-0.7,0) 2(0.7,0)
CONN-SMD_2P-P1.25_XUNPU_WAFER-MX1.25-2PWB
  rect 0.7x1.7 smd: 1(-0.625,1.25) 2(0.625,1.25)
  rect 1.8x2.5 smd: 3(3.075,-1.25) 4(-3.075,-1.25)
HDR-TH_6P-P2.54-V-M-1
  rect 1.8x1.8 hole 1.2: 1(-6.35,0)
  round 1.8 hole 1.2: 2(-3.81,0) 3(-1.27,0) 4(1.27,0) 5(3.81,0) 6(6.35,0)
KEY-SMD_4P-L12.0-W12.0-P5.00-LS15.2
  rect 2.4x2.2 smd: 1(-7.3,2.5) 2(7.3,2.5) 3(-7.3,-2.5) 4(7.3,-2.5)
LED0603-RD_RED
  rect 0.8x0.8 smd: 1(-0.799,-0.004) 2(0.799,0.004)
LGA-14_L3.0-W2.5-P0.50-BL
  rect 0.28x0.785 smd: 1(-0.75,-1.393) 2(-0.25,-1.393) 3(0.25,-1.393) 4(0.75,-1.393) 8(0.75,1.393) 9(0.25,1.393) 10(-0.25,1.393) 11(-0.75,1.393)
  rect 0.785x0.28 smd: 5(1.143,-0.5) 6(1.143,0) 7(1.143,0.5) 12(-1.143,0.5) 13(-1.143,0) 14(-1.143,-0.5)
LGA-16_L3.0-W3.0-P0.50-BL_SQ
  rect 0.25x0.45 smd: 1(-0.75,-1.263) 2(-0.25,-1.263) 3(0.25,-1.263) 4(0.75,-1.263) 9(0.75,1.263) 10(0.25,1.263) 11(-0.25,1.263) 12(-0.75,1.263)
  rect 0.45x0.25 smd: 5(1.263,-0.75) 6(1.263,-0.25) 7(1.263,0.25) 8(1.263,0.75) 13(-1.263,0.75) 14(-1.263,0.25) 15(-1.263,-0.25) 16(-1.263,-0.75)
R0603
  rect 0.806x0.864 smd: 1(-0.753,0) 2(0.753,0)
R1210
  rect 1.282x2.808 smd: 1(-1.441,0) 2(1.441,0)
RES-ADJ-TH_Y16-YZL7.2-B5KB55-G-C01
  round 1.6 hole 1: 1(8.15,-2.5) 2(8.15,0) 3(8.15,2.5)
  round 2.1 hole 1.5: 4(5.15,-7.75) 5(5.15,7.75) 6(-8.15,7.75) 7(-8.15,-7.75)
SOT-23-5_L2.9-W1.6-P0.95-LS2.8-BL
  rect 0.6x1 smd: 1(-0.95,-1.1) 2(0,-1.1) 3(0.95,-1.1) 4(0.95,1.1) 5(-0.95,1.1)
SOT-23-5_L3.0-W1.7-P0.95-LS2.8-BL
  rect 0.49x1.157 smd: 1(-0.95,-1.153) 2(0,-1.153) 3(0.95,-1.153)
  rect 0.49x1.175 smd: 4(0.95,1.153) 5(-0.95,1.153)
SW-SMD_L3.9-W3.0-P4.45
  rect 1.23x1.36 smd: 1(-2.185,0) 2(2.185,0)
SW-TH_RKJXV1224005
  round 1.8 hole 1.2: 1(7.527,-1.719) 2(7.527,0.781) 3(7.527,3.281) 4(1.298,9.511) 5(-1.202,9.511) 6(-3.703,9.511)
  round 2.5 hole 1.8: 7(-7.527,5.781) 8(-7.527,-4.219) 9(5.122,-4.219) 10(5.122,5.781)
  round 2.2 hole 1.6: a(-4.721,-5.011) b(-4.721,-9.511) c(2.279,-5.011) d(2.279,-9.511)
SW-TH_SK12D07VG3
  oval 1.6x1.6 hole 1: 1(-2,0) 2(0,0) 3(2,0)
  oval 2x2.6 hole 1x1.4: 4(4.15,0) 5(-4.15,0)
TYPE-C-SMD_TYPE-C-6P_5
  oval 1.1x1.7 hole 0.7x1.2: 7(-4.32,-2.025) 7(-4.32,1.775) 7(4.32,-2.025) 7(4.32,1.775)
  rect 0.7x1.2 smd: A5(-0.5,2.025) A9(1.5,2.025) B5(0.5,2.025) B9(-1.5,2.025)
  rect 0.8x1.2 smd: A12(2.7,2.025) B12(-2.7,2.025)
WIRELM-SMD_ESP32-S
  rect 3x1 smd: 1(-9,9.005) 2(-9,7.735) 3(-9,6.465) 4(-9,5.195) 5(-9,3.925) 6(-9,2.655) 7(-9,1.385) 8(-9,0.115) 9(-9,-1.155) 10(-9,-2.425) 11(-9,-3.695) 12(-9,-4.965) 13(-9,-6.235) 14(-9,-7.505) 25(9,-7.505) 26(9,-6.235) 27(9,-4.965) 28(9,-3.695) 29(9,-2.425) 30(9,-1.155) 31(9,0.115) 32(9,1.385) 33(9,2.655) 34(9,3.925) 35(9,5.195) 36(9,6.465) 37(9,7.735) 38(9,9.005)
  rect 1x3 smd: 15(-5.715,-9.005) 16(-4.445,-9.005) 17(-3.175,-9.005) 18(-1.905,-9.005) 19(-0.635,-9.005) 20(0.635,-9.005) 21(1.905,-9.005) 22(3.175,-9.005) 23(4.445,-9.005) 24(5.715,-9.005)
  rect 3.6x3.6 smd: 39(-1.105,1.815)

## Nets
As in the schematic.

Pads without a net: R4 4 5 6 7; SW1 c d; SW2 4 5; SW5 3; SW6 3; SW9 3; U1 8 9 10 11 12 14 17 18 19 20 21 22 23 24 26 29 32 33; U2 3 5 6 7 14 15; U3 2 3 4 9 10 11; U5 3 4; U6 4

## Via types
v1: diameter 0.61, hole 0.305, Top Layer to Bottom Layer, 182 vias

## Routing (per net, layer and track width the routed paths; a pad name or vN(x,y) marks a point on that pad's centre or on a via; arc(x,y) is an arc through that point)
+5V: length 12.7
  Bottom Layer w0.635: 7.6,9.88 10.61,12.9 R11.2 ; 7.6,9.88 7.62,9.85 7.62,7.26 USB1.B9 ; 7.6,9.88 7.11,9.4 5.46,9.4 4.6,8.53 USB1.A9
GND:
  vias: v1(5.44,91.8) v1(5.44,86.72) v1(5.44,81.64) v1(5.44,76.56) v1(5.44,71.48) v1(5.44,66.4) v1(5.44,61.32) v1(5.44,56.24) v1(5.44,51.16) v1(5.44,46.08) v1(5.44,41) v1(5.44,30.84) v1(5.44,5.44) v1(10.52,91.8) v1(10.52,86.72) v1(10.52,81.64) v1(10.52,76.56) v1(10.52,51.16) v1(10.52,46.08) v1(10.52,41) v1(10.52,30.84) v1(10.52,10.52) v1(10.8,21.08) v1(12.45,29.72) v1(12.57,34.04) v1(13.33,11.81) v1(13.72,14.22) v1(14.54,18.67) v1(15.6,91.8) v1(15.6,71.48) v1(15.6,66.4) v1(15.6,51.16) v1(15.6,46.08) v1(16.5,21.46) v1(16.51,19.18) v1(20.68,76.56) v1(20.68,71.48) v1(20.68,66.4) v1(20.68,61.32) v1(20.68,56.24) v1(20.68,51.16) v1(20.68,15.6) v1(20.68,5.44) v1(21.21,28.66) v1(21.21,24.76) v1(23.11,22.86) v1(25.76,86.72) v1(25.76,81.64) v1(25.76,76.56) v1(25.76,71.48) v1(25.76,66.4) v1(25.76,61.32) v1(25.76,56.24) v1(25.76,51.16) v1(26.8,18.03) v1(30.84,86.72) v1(30.84,81.64) v1(30.84,71.48) v1(30.84,66.4) v1(30.84,51.16) v1(30.84,15.6) v1(34.64,32.89) v1(35.92,91.8) v1(35.92,86.72) v1(35.92,81.64) v1(35.92,76.56) v1(35.92,71.48) v1(35.92,66.4) v1(35.92,61.32) v1(35.92,46.08) v1(35.92,25.76) v1(35.92,15.6) v1(36.07,32.89) v1(39.4,27.4) v1(39.75,16.64) v1(41,91.8) v1(41,86.72) v1(41,81.64) v1(41,76.56) v1(41,71.48) v1(41,66.4) v1(41,51.16) v1(41,46.08) v1(41,41) v1(41.02,32.26) v1(41.02,27.43) v1(42.55,16) v1(42.55,12.73) v1(42.55,9.7) v1(42.55,6.86) v1(46.08,91.8) v1(46.08,86.72) v1(46.08,81.64) v1(46.08,76.56) v1(46.08,71.48) v1(46.08,61.32) v1(46.08,51.16) v1(46.08,46.08) v1(46.08,41) v1(46.08,35.92) v1(46.08,30.84)
VCC: length 255.7
  Top Layer w0.254: v1(39.72,31.62) 38.56,31.62 37.8,30.86 v1(37.8,28.7) 35.92,26.82 v1(35.65,26.82) ; v1(27.05,86.99) 25.86,88.19 25.86,91.13 ; v1(14.35,13.46) 16.38,15.49 v1(16.38,16.38)
  Top Layer w0.508: v1(12.51,25.91) v1(12.51,25.01) 12.51,16.06 12.45,16 12.45,14.73 11.68,13.97 11.68,12.7 12.45,11.94 v1(12.45,9.91) ; v1(19.3,1.27) v1(40.01,1.27)
  Top Layer w0.635: v1(40.01,1.27) 40.06,1.27 v1(41.01,2.22) 41.27,2.48 41.27,18.16 42.8,19.69 42.8,28.45 43.57,29.22 43.57,37.07 41.27,39.37 37.46,39.37 36.57,38.47 v1(36.57,37.09) v1(36.57,36.02)
  Bottom Layer w0.254: v1(12.45,9.91) 14.35,11.81 v1(14.35,13.46) ; U3.5 36.63,29.86 v1(37.8,28.7) 37.81,28.71 U2.13 ; R15.2 15.5,77.48 22.64,84.61 24.67,84.61 v1(27.05,86.99) 28.26,88.2 C1.2 ; R8.2 R9.2 18.15,18.15 v1(16.38,16.38) ; 35.65,27.97 v1(35.65,26.82) 33.63,26.82 32.81,27.64 32.81,28.68 32.99,28.86 U3.12 ; R3.1 37.06,34.29 v1(39.72,31.62) ; U2.4 40.7,31.25 40.34,31.62 v1(39.72,31.62) ; v1(39.72,31.62) 39.7,31.6 U2.2
  Bottom Layer w0.508: R15.2 15.24,76.2 17.53,73.91 21.21,73.91 29.72,65.4 32.12,65.4 34.42,63.11 ; C3.2 41.01,1.32 v1(41.01,2.22) U1.2 ; v1(19.3,1.27) 19.3,3.05 v1(12.45,9.91) ; U6.5 13.78,20.13 13.1,20.81 13.1,23.15 C13.2 v1(12.51,25.01) ; R2.2 v1(40.01,1.27)
  Bottom Layer w0.635: v1(36.57,37.09) 36.57,39.51 29.59,46.48 29.59,48.25 R1.2 R7.2 31.23,49.91 34.92,53.59 H1.1 38.62,63.11 34.42,63.11 ; v1(36.57,36.02) R3.1
A_GX: length 54.2
  Top Layer w0.381: v1(38.48,9.02) 38.48,14.48 36.32,16.64 27.18,16.64 22.35,21.46 v1(22.35,24.64)
  Bottom Layer w0.381: U1.4 38.48,4.22 v1(38.48,9.02) ; SW1.5 24.32,26.61 v1(22.35,24.64)
A_GY: length 52.3
  Top Layer w0.381: v1(37.21,7.24) 38.61,7.24 40,8.64 40,14.48 36.32,18.16 27.94,18.16 23.88,22.22 v1(23.88,23.75)
  Bottom Layer w0.381: U1.5 37.21,4.22 v1(37.21,7.24) ; SW1.2 30.88,36.85 28.7,34.67 26.92,34.67 25.15,32.89 25.15,25.02 v1(23.88,23.75)
A_TRIG: length 103.4
  Top Layer w0.381: v1(15.37,10.79) 34.16,10.79 v1(35.94,9.02) ; v1(14.48,47.62) v1(14.48,35.05)
  Bottom Layer w0.381: v1(14.48,47.62) 14.48,51.18 11.43,54.23 11.43,74.42 13.21,76.2 13.21,82.7 R4.2 ; v1(15.37,10.79) 15.62,11.05 15.62,33.91 v1(14.48,35.05) ; v1(35.94,9.02) 35.94,4.22 U1.6
BAT: length 35.6
  Top Layer w0.254: v1(20.57,4.19) 31.62,4.19 v1(34.67,7.24) ; v1(12.7,13.59) 13.97,12.32 v1(13.97,9.91)
  Bottom Layer w0.254: v1(12.7,13.59) 12.71,13.6 R14.2 12.71,15.51 R13.1 ; v1(20.57,4.19) 19.68,4.19 v1(13.97,9.91) ; U1.7 34.67,4.22 v1(34.67,7.24)
BAT+: length 23.8
  Bottom Layer w0.254: U6.3 10.48,22.03 8.58,20.13 ; R13.2 12,17.73 12,18.67
  Bottom Layer w0.635: C8.2 5.91,26.89 U5.2 ; C8.2 8.25,19.81 8.58,20.13 U6.1 12,20.06 12,18.67 ; C8.2 5.91,17.11 U4.3
BAT-: length 2.3
  Top Layer w0.635: v1(4.83,18.41) v1(7.12,18.41)
BTN_GRIP: length 110.1
  Top Layer w0.254: SW7.2 43.05,47.09 v1(43.05,42.67) ; v1(38.61,17.78) 42.04,21.21 42.04,33.51 SW7.1 41.66,34.82 v1(41.66,36.83) ; v1(27.43,15.75) 22.61,15.75 v1(18.92,19.43) 18.92,25.91 13.08,31.75 6.84,31.75 SW6.1 SW6.2
  Bottom Layer w0.254: v1(43.05,42.67) 43.05,38.23 v1(41.66,36.83) ; v1(27.43,15.75) 29.46,17.78 v1(38.61,17.78) ; U1.28 29.58,20.82 28.5,19.74 24.07,19.74 22.59,21.21 C6.2 20,20.51 v1(18.92,19.43)
BTN_MENU: length 60.5
  Top Layer w0.254: v1(30.86,19.81) v1(30.86,25.95) ; v1(21.08,42.67) 23.11,40.64 23.11,34.42 26.16,31.37 v1(26.16,29.08) ; v1(19.56,52.07) 19.56,58.83 SW5.1
  Bottom Layer w0.254: v1(30.86,19.81) 39.23,19.81 39.74,20.32 U1.36 ; v1(26.16,29.08) 26.92,28.32 29.65,28.32 C5.2 30.86,27.11 v1(30.86,25.95) ; v1(19.56,52.07) 19.56,44.2 v1(21.08,42.67)
BTN_SYS: length 27.4
  Top Layer w0.254: SW9.1 17.21,22.54 16.51,23.24 16.51,24.32 v1(17.21,25.02)
  Bottom Layer w0.254: v1(17.21,25.02) 17.97,25.02 C7.2 21.46,22.99 24.26,20.19 27.81,20.19 28.31,20.69 U1.27
BTN_TRIG: length 33.3
  Top Layer w0.254: v1(28.7,19.18) 25.91,21.97 25.91,25.95 SW1.a
  Bottom Layer w0.254: C4.2 20.45,31.06 SW1.a ; v1(28.7,19.18) 40.51,19.18 41.01,19.67 U1.37
CAL: length 5
  Bottom Layer w0.254: U1.16 22.61,8.76 22.1,8.25 22.1,6 SW3.1
EN: length 125
  Top Layer w0.254: v1(39.62,6.86) 35.81,3.05 19.3,3.05 17.4,4.95 9.27,4.95 8.76,5.46 8.76,8.13 9.65,9.02 9.65,25.02 12.83,28.19 v1(14.1,28.19) ; v1(37.34,56.26) 44.83,63.75 H1.5 ; v1(24.51,50.93) 19.81,46.23 v1(17.91,46.23) ; v1(14.1,32.51) 15.49,33.91 v1(15.49,39.12)
  Bottom Layer w0.254: v1(24.51,50.93) 29.84,56.26 v1(37.34,56.26) ; v1(15.49,39.12) 15.49,43.81 v1(17.91,46.23) ; C2.1 R2.1 38.36,2.16 39.12,2.16 39.74,2.78 U1.3 39.74,6.74 v1(39.62,6.86) ; v1(14.1,32.51) v1(14.1,28.19)
IO0: length 59.7
  Top Layer w0.254: v1(29.65,53.15) 23.11,46.61 v1(23.11,42.93) ; v1(26.03,27.69) 23.24,30.48 v1(23.24,31.88) ; H1.6 46.23,66.29 v1(34.8,54.86) ; v1(22.1,35.43) v1(22.1,39.88)
  Bottom Layer w0.254: v1(29.65,53.15) 31.37,54.86 v1(34.8,54.86) ; U1.25 26.03,22.47 v1(26.03,27.69) ; v1(23.24,31.88) 22.1,33.02 v1(22.1,35.43) ; v1(22.1,39.88) 23.11,40.89 v1(23.11,42.93)
LED: length 105.6
  Top Layer w0.254: v1(18.8,17.14) 18.8,18.73 18.34,19.19 18.34,22.81 v1(17.4,23.75) ; v1(16.89,29.72) 15.62,30.99 15.62,32.64 17.14,34.16 17.14,36.83 19.94,39.62 19.94,42.67 16.76,45.85 16.76,52.58 v1(16,53.34) ; 23.27,91.13 23.27,84.73 22.61,84.07 22.61,76.71 16.64,70.74 v1(13.72,70.74) ; v1(27.04,9.4) v1(20.95,9.4)
  Bottom Layer w0.254: v1(16.89,29.72) 16.51,29.34 16.51,24.64 v1(17.4,23.75) ; U1.13 v1(27.04,9.4) ; v1(16,53.34) 13.72,55.63 v1(13.72,70.74) ; v1(18.8,17.14) 18.8,15.62 20.95,13.46 v1(20.95,9.4)
RXD: length 60.9
  Top Layer w0.254: H1.2 40.64,56.13 27.18,42.67 27.18,36.32 29.46,34.04 31.37,34.04 v1(32.64,32.77) ; v1(31.62,27.43) 31.62,23.24 33.02,21.84 34.92,21.84 v1(37.85,24.76)
  Bottom Layer w0.254: v1(37.85,24.76) 38.47,24.14 U1.35 ; v1(32.64,32.77) 32.64,31.11 31.24,29.72 31.24,27.81 v1(31.62,27.43)
SCL: length 18.7
  Top Layer w0.254: v1(36.93,31.74) 33.34,31.74 31.98,30.38 v1(31.98,29.36)
  Bottom Layer w0.254: v1(36.93,31.74) 38.74,31.74 39.2,31.28 U2.1 ; U3.13 v1(31.98,29.36) 32.26,29.08 32.26,22.35 U1.30
SDA: length 15.3
  Top Layer w0.254: v1(36.93,30.63) 33.38,30.63 v1(32.87,30.12) 32.89,30.1 v1(32.89,26.03)
  Bottom Layer w0.254: U1.31 33.39,25.54 v1(32.89,26.03) ; U3.14 33.75,29.87 33.12,29.87 v1(32.87,30.12) ; U2.16 38.65,30.25 37.31,30.25 v1(36.93,30.63)
TXD: length 62.1
  Top Layer w0.254: H1.3 42.16,58.67 26.29,42.8 26.29,34.67 v1(27.43,33.53) ; v1(36.7,25.02) 34.29,22.61 33.15,22.61 32.26,23.49 32.26,27.69 30.73,29.21 v1(28.58,29.21)
  Bottom Layer w0.254: v1(27.43,33.53) 26.03,32.13 26.03,30.61 27.43,29.21 v1(28.58,29.21) ; v1(36.7,25.02) 37.2,24.52 U1.34
$1N14743: length 2
  Bottom Layer w0.254: 4.35,13.18 4.35,11.2 LED2.2
$1N14744: length 10.4
  Top Layer w0.254: v1(7.11,11.18) 2.67,15.62 v1(2.67,17.14)
  Bottom Layer w0.254: LED2.1 5.93,11.18 v1(7.11,11.18) ; U4.1 3.96,17.14 v1(2.67,17.14)
$1N14746: length 1.2
  Bottom Layer w0.254: R12.1 3.95,14.85 U4.5
$1N15140: length 7.5
  Bottom Layer w0.254: C11.2 41.34,25.15 38.86,25.15 38.61,25.4 38.61,27.43 39.2,28.03 39.2,28.2
$1N15141: length 2.8
  Bottom Layer w0.254: C11.1 41.66,26.86 41.66,28.27 U2.8
$1N15144: length 2.3
  Bottom Layer w0.254: C9.1 40.2,27.18 40.2,28.2
$1N15837: length 4.9
  Top Layer w0.254: v1(3.81,9.27) 4.95,9.27 v1(5.71,8.51)
  Bottom Layer w0.254: v1(5.71,8.51) 5.71,7.35 USB1.B5 ; R6.2 3.3,8.76 v1(3.81,9.27)
$1N15838: length 6
  Top Layer w0.254: v1(4.06,10.16) 4.95,10.16 v1(6.6,8.51)
  Bottom Layer w0.254: v1(6.6,8.51) 6.6,7.24 USB1.A5 ; v1(4.06,10.16) 2.79,10.16 R5.2
$1N20609: length 2
  Bottom Layer w0.254: SW1.1 33.11,34.29 R3.2
$1N20611: length 3.2
  Bottom Layer w0.254: SW1.4 28.08,46.83 R1.1
$1N24568: length 13.3
  Top Layer w0.254: SW9.2 22.65,13.04 v1(21.46,14.22)
  Bottom Layer w0.254: R9.1 v1(21.46,14.22)
$1N24570: length 15.6
  Top Layer w0.254: SW5.2 32.04,61.81 v1(33.53,60.32) 33.53,55.37 v1(32,53.85)
  Bottom Layer w0.254: v1(32,53.85) 32,53.84 R7.1
$1N30109: length 3.2
  Bottom Layer w0.254: R15.1 15.24,82.19 R4.1

## Copper pours and planes (outline as drawn; the poured copper is in the pictures)
GND on Top Layer: 0,94.11 50.04,94.11 50.04,0 0,0
GND on Top Layer: 24.23,93.35 24.93,93.35 24.93,88.52 24.23,88.52
GND on Bottom Layer: 0,94.11 50.04,94.11 50.04,0 0,0
VCC on Top Layer: 25.53,93.35 26.23,93.35 26.23,88.52 25.53,88.52
(no net) on Top Layer: 26.83,93.34 27.53,93.34 27.53,88.52 26.83,88.52
BAT- on Bottom Layer: 0,28.83 10.73,28.83 10.73,0 0,0
LED on Top Layer: 22.93,93.35 23.63,93.35 23.63,88.52 22.93,88.52
$1N14747 on Bottom Layer: 5.46,17.02 8.38,17.02 8.38,12.32 5.46,12.32

Small or netless copper shapes (teardrops, artwork), in the pictures only: 97 on Top Layer, 182 on Bottom Layer

# Board PCB1_1
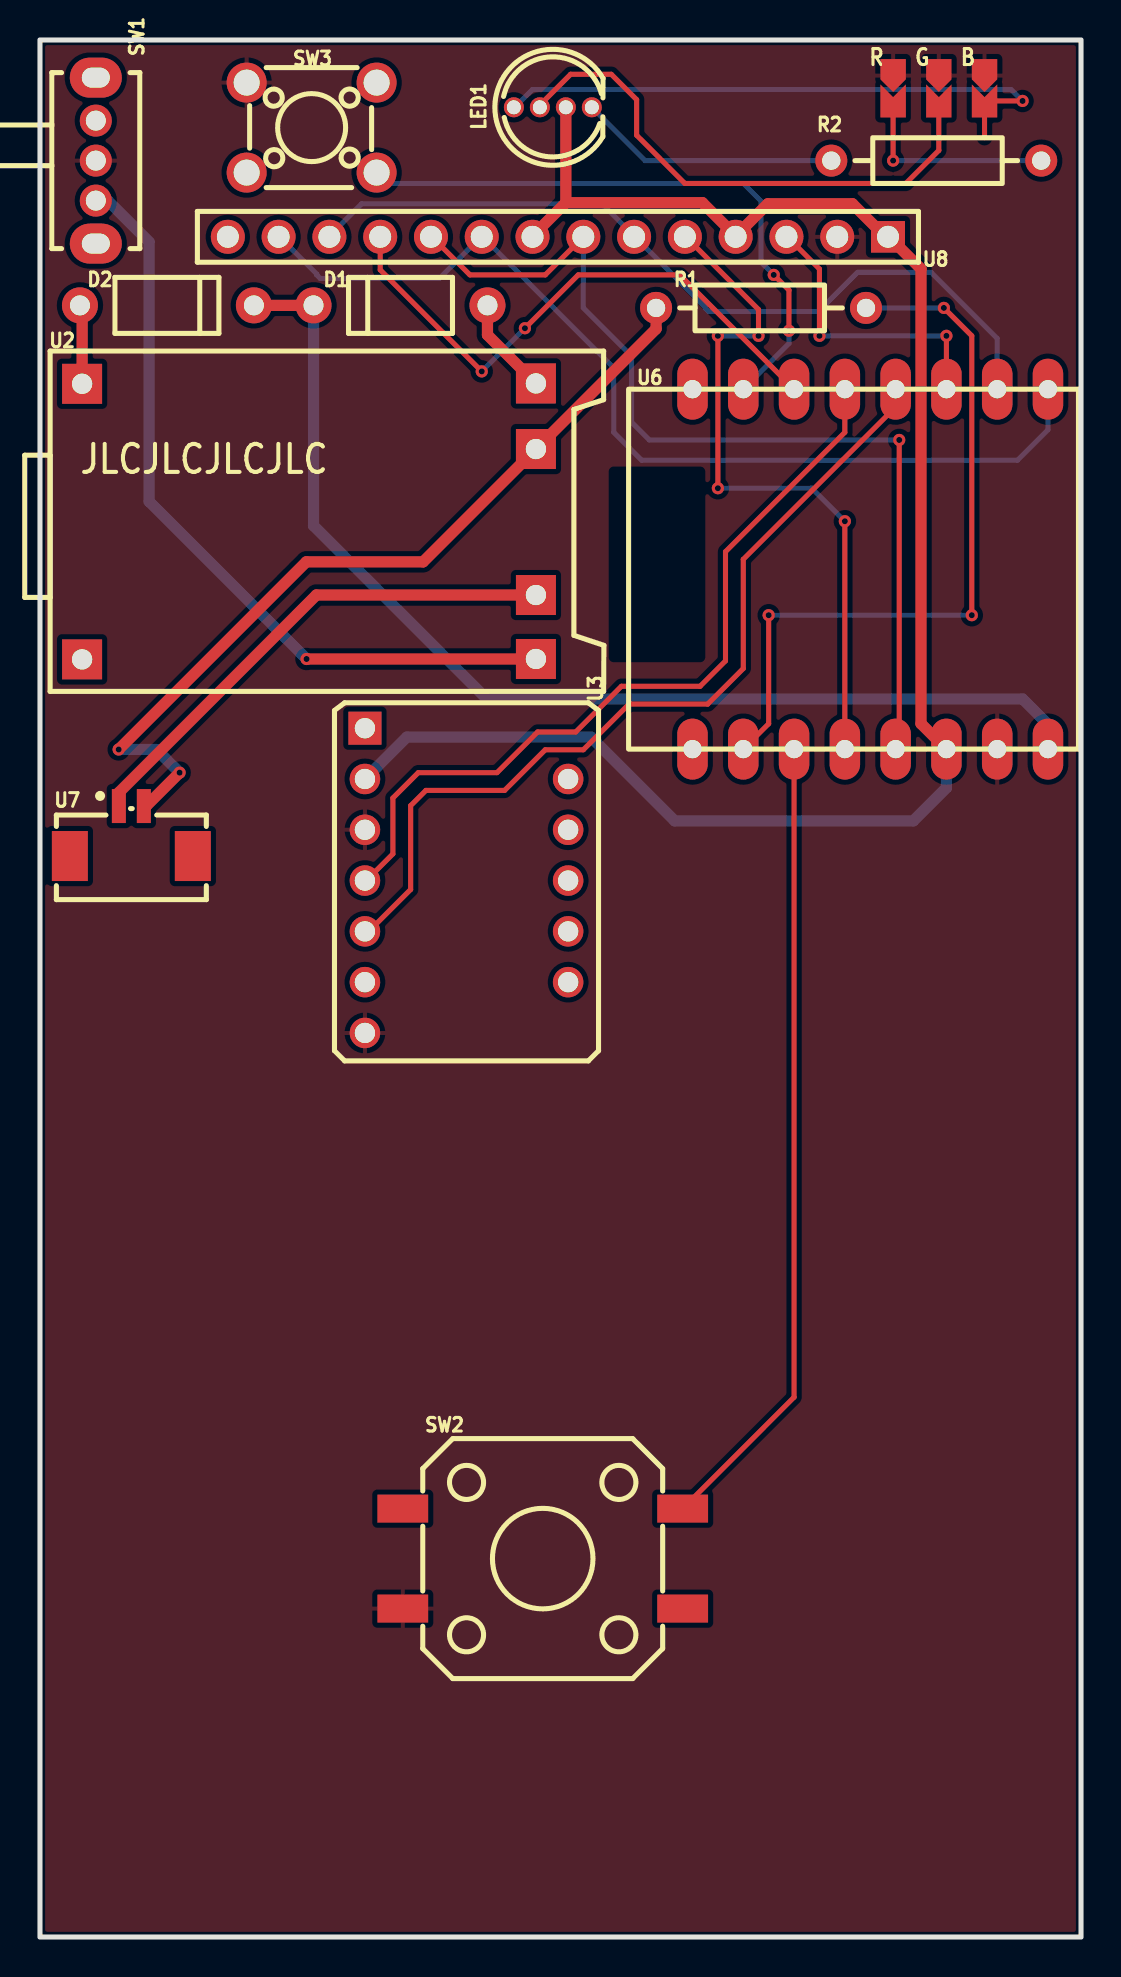
[diagram p4: board, top side]
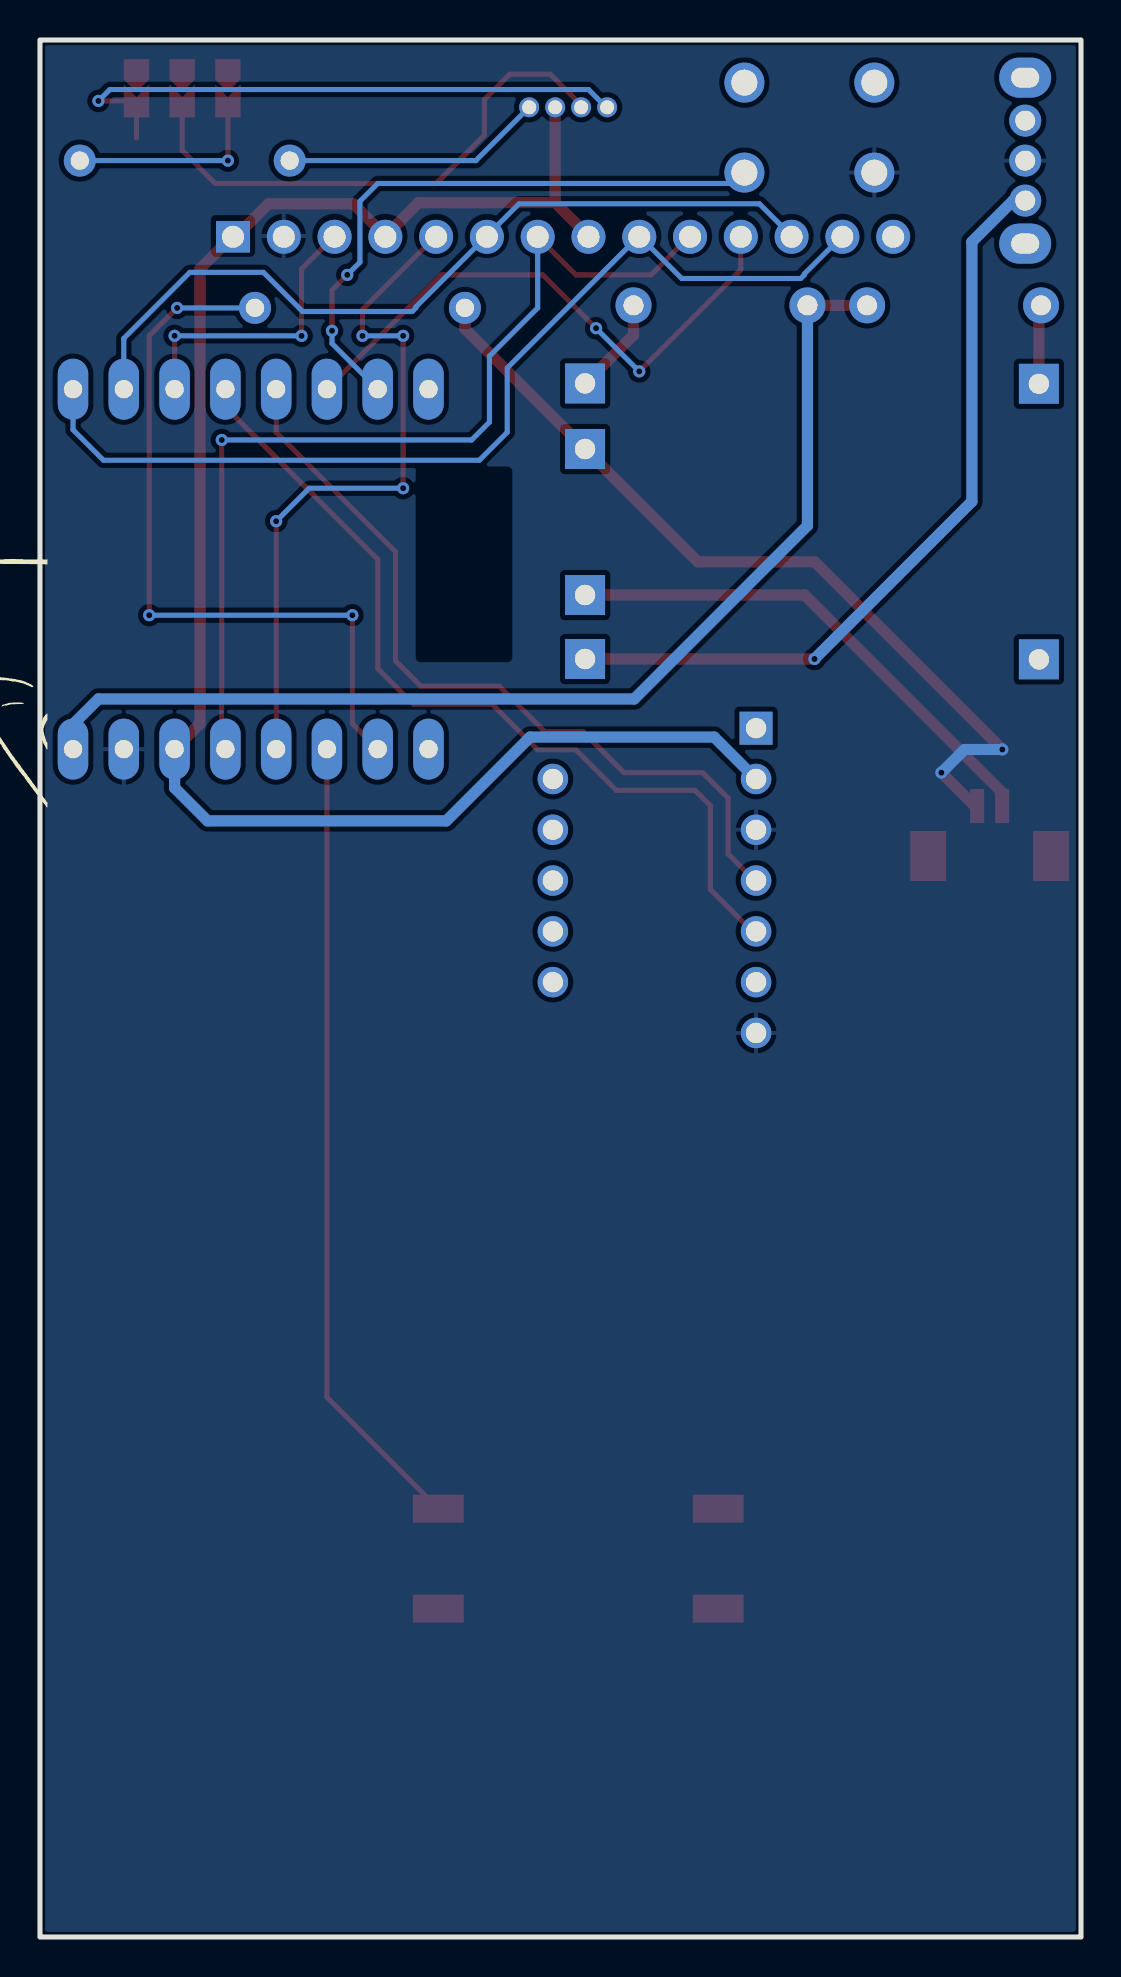
[diagram p5: board, bottom side, seen from below]

Outline 52.07 x 94.87 mm; copper layers: Top Layer, Bottom Layer. Coordinates in mm from the lower left corner of the outline.
Outline path: rectangle 0,94.87 52.07,0
Stack: Top Layer 0.035mm / Dielectric1 1.51mm FR4 er 4.5 / Bottom Layer 0.035mm

## Design rules (mm)
template: 自定义配置
spacing copperThickness1oz: track to track 0.102, other pairs 0.152 to 0.3
spacing copperThickness2oz (default): track to track 0.203, other pairs 0.152 to 0.3
track width copperThickness1oz: min 0.127, default 0.254, max 2.54
track width copperThickness2oz (default): min 0.203, default 0.254, max 2.54
track width 5.6mm: min 0.56, default 0.56, max 0.56
differential pair differentialPair (default): width min 0.127, default 0.254, max 2.54; gap min 0.152, default 0.152
via viaSize (default): diameter min 0.5, default 0.61, max 10; hole min 0.3, default 0.305, max 6.3
net VCC uses 5.6mm
net $1N1373 uses 5.6mm
net $1N1387 uses 5.6mm
net GND uses 5.6mm
net $1N976 uses 5.6mm
net BAT+ uses 5.6mm
net BAT- uses 5.6mm
net +5V uses 5.6mm

## Placement (name value [footprint] x y rotation side)
D1  1N5817  [DO-41_BD2.4-L4.7-P8.70-D0.9-RD]  18.03 81.6 0 top
D2  1N5817  [DO-41_BD2.4-L4.7-P8.70-D0.9-RD]  6.35 81.6 180 top
LED1  TJ-L5FYTXHTCYLCRGB-A5  [LED-TH_4P-BD5.8-P1.30]  25.65 91.5 0 top
NOREF  -  [Pad_e6462]  42.67 91.82 0 top
NOREF#2  -  [Pad_e6464]  44.96 91.82 0 top
NOREF#3  -  [Pad_e6461]  42.67 93.09 0 top
NOREF#4  -  [Pad_e6466]  47.24 91.82 0 top
NOREF#5  -  [Pad_e6465]  47.24 93.09 0 top
NOREF#6  -  [Pad_e6463]  44.96 93.09 0 top
R1  180kΩ  [RES-TH_BD2.2-L6.5-P10.50-D0.6]  36.07 81.47 180 top
R2  62Ω  [RES-TH_BD2.2-L6.5-P10.50-D0.6]  44.83 88.84 0 top
SW1  SK12D07VG3  [SW-TH_SK12D07VG3]  2.79 88.84 270 top
SW2  KH-12X12X11H-SMT-D  [SW-SMD_4P-L12.0-W12.0-P5.00-LS15.2]  25.15 18.92 180 top
SW3  PTS645SL43-2 LFS  [KEY-TH_4P-L6.0-W6.0-P4.50-LS6.50]  13.59 90.49 180 top
U2  -  [TP4056]  13.21 70.29 0 top
U3  -  [BMI160]  21.33 52.77 0 top
U6  -  [【封装Supermini】]  39.24 68.52 270 top
U7  WAFER-MX1.25-2PWB  [CONN-SMD_2P-P1.25_XUNPU_WAFER-MX1.25-2PWB]  4.57 55.31 0 top
U8  PM254-1-14-Z-8.5  [HDR-TH_14P-P2.54-V-F-1]  25.91 85.03 180 top

## Footprints (pads in the part's own frame, mm; a bottom-side part is the same pattern mirrored in y, then rotated)
BMI160
  rect 1.651x1.651 hole 1.016: 1(-5.082,7.684)
  round 1.524 hole 1.016: 2(-5.082,5.144) 3(-5.082,2.603) 4(-5.082,0.064) 5(-5.082,-2.477) 6(-5.082,-5.016) 7(-5.082,-7.556) 8(5.082,5.144) 9(5.082,2.603) 10(5.082,0.064) 11(5.082,-2.477) 12(5.082,-5.016)
CONN-SMD_2P-P1.25_XUNPU_WAFER-MX1.25-2PWB
  rect 0.7x1.7 smd: 1(-0.625,1.25) 2(0.625,1.25)
  rect 1.8x2.5 smd: 3(3.075,-1.25) 4(-3.075,-1.25)
DO-41_BD2.4-L4.7-P8.70-D0.9-RD
  round 1.8 hole 1: 1(-4.35,0) 2(4.35,0)
HDR-TH_14P-P2.54-V-F-1
  rect 1.7x1.575 hole 1.1: 1(-16.51,0)
  round 1.7 hole 1.1: 2(-13.97,0) 3(-11.43,0) 4(-8.89,0) 5(-6.35,0) 6(-3.81,0) 7(-1.27,0) 8(1.27,0) 9(3.81,0) 10(6.35,0) 11(8.89,0) 12(11.43,0) 13(13.97,0) 14(16.51,0)
KEY-TH_4P-L6.0-W6.0-P4.50-LS6.50
  round 2 hole 1.3: 1(-3.25,2.25) 2(3.25,2.25) 3(-3.25,-2.25) 4(3.25,-2.25)
LED-TH_4P-BD5.8-P1.30
  round 1 hole 0.7: 1(1.95,0) 2(0.65,0) 3(-0.65,0) 4(-1.95,0)
Pad_e6461
  custom 1.27x1.651 smd: 17(0,0)
Pad_e6462
  custom 1.27x1.651 smd: 18(0,0)
Pad_e6463
  custom 1.27x1.651 smd: 17(0,0)
Pad_e6464
  custom 1.27x1.651 smd: 18(0,0)
Pad_e6465
  custom 1.27x1.651 smd: 17(0,0)
Pad_e6466
  custom 1.27x1.651 smd: 18(0,0)
RES-TH_BD2.2-L6.5-P10.50-D0.6
  round 1.6 hole 0.914: 1(-5.25,0) 2(5.25,0)
SW-SMD_4P-L12.0-W12.0-P5.00-LS15.2
  rect 2.54x1.4 smd: 1(-7,2.5) 2(7,2.5) 3(-7,-2.5) 4(7,-2.5)
SW-TH_SK12D07VG3
  oval 1.6x1.6 hole 1: 1(-2,0) 2(0,0) 3(2,0)
  oval 2x2.6 hole 1x1.4: 4(4.15,0) 5(-4.15,0)
TP4056
  rect 2x2 hole 1.016: 1(-11.1,7.381) 2(-11.1,-6.4) 3(11.6,4.119) 4(11.6,-3.182) 5(11.6,7.4) 6(11.6,-6.381)
【封装Supermini】
  oval 3.048x1.524 hole 0.914: 1(-8.89,11.176) 2(-8.89,8.636) 3(-8.89,6.096) 4(-8.89,3.556) 5(-8.89,1.016) 6(-8.89,-1.524) 7(-8.89,-4.064) 8(-8.89,-6.604) 9(9.11,-6.604) 10(9.11,-4.064) 11(9.11,-1.524) 12(9.11,1.016) 13(9.11,3.556) 14(9.11,6.096) 15(9.11,8.636) 16(9.11,11.176)

## Nets
As in the schematic, except:
GND: NOREF#3.17 NOREF#5.17 NOREF#6.17 SW1.2 SW2.2 SW3.4 U3.3 U3.7 U6.15 U8.2
B: LED1.4 NOREF#4.18
G: LED1.3 NOREF#2.18
R: NOREF.18 R2.2

Pads without a net: SW1 1 4 5; SW2 1 4; SW3 2 3; U2 2; U3 1 6 8 9 10 11 12; U6 8 9; U7 3 4; U8 14

## Via types
v1: diameter 0.61, hole 0.305, Top Layer to Bottom Layer, 19 vias

## Routing (per net, layer and track width the routed paths; a pad name or vN(x,y) marks a point on that pad's centre or on a via; arc(x,y) is an arc through that point)
+5V: length 56.1
  Top Layer w0.56: D2.1 D1.1
  Bottom Layer w0.56: D1.1 13.68,70.58 22.35,61.91 49.15,61.91 50.42,60.64 U6.16
VCC: length 86.4
  Top Layer w0.56: LED1.2 26.3,86.73 ; 26.3,86.73 24.64,85.07 ; 26.3,86.73 33.13,86.73 34.8,85.07 36.41,86.68 40.64,86.68 42.25,85.07 42.42,85.07 44.07,83.42 44.07,60.68 U6.14
  Bottom Layer w0.56: U3.2 18.35,60.01 27.56,60.01 31.75,55.82 43.69,55.82 45.34,57.47 U6.14
B: length 29.8
  Top Layer w0.254: v1(49.15,91.82) NOREF#4.18 47.24,89.98
  Bottom Layer w0.254: v1(49.15,91.82) 48.58,92.39 24.64,92.39 23.75,91.5 LED1.4
BAT: length 37.2
  Top Layer w0.254: v1(36.45,66.1) 36.45,60.68 U6.10 ; v1(46.61,66.1) 46.61,80.07 v1(45.21,81.47)
  Bottom Layer w0.254: v1(45.21,81.47) R1.1 ; v1(36.45,66.1) v1(46.61,66.1)
BAT+: length 42.6
  Top Layer w0.56: v1(6.98,58.23) 5.31,56.56 U7.2 ; v1(3.94,59.39) 13.32,68.77 19.16,68.77 U2.3 30.82,80.42 R1.2
  Bottom Layer w0.56: v1(3.94,59.39) 5.83,59.39 v1(6.98,58.23)
BAT-: length 25.6
  Top Layer w0.56: U2.4 13.82,67.11 3.94,57.23 U7.1
BTN: length 40.3
  Top Layer w0.254: SW2.3 37.72,27 U6.11
CAL: length 30.7
  Top Layer w0.254: v1(36.7,83.12) 37.46,82.36 v1(37.46,80.33)
  Bottom Layer w0.254: v1(36.7,83.12) 36.07,83.76 36.07,86.8 35.18,87.69 17.38,87.69 SW3.1 ; U6.7 37.46,79.69 v1(37.46,80.33)
DC: length 34.6
  Top Layer w0.254: 32.26,85.07 35.94,81.39 v1(35.94,80.07) ; U6.12 v1(40.26,70.8) ; v1(33.91,72.45) v1(33.91,80.07)
  Bottom Layer w0.254: v1(40.26,70.8) 38.61,72.45 v1(33.91,72.45) ; v1(33.91,80.07) v1(35.94,80.07)
DCS: length 14.8
  Top Layer w0.254: U6.3 45.52,77.59 45.52,77.84 45.34,78.02 v1(45.34,80.07) ; 37.34,85.07 38.99,83.42 v1(38.99,80.07)
  Bottom Layer w0.254: v1(45.34,80.07) v1(38.99,80.07)
G: length 27.2
  Top Layer w0.254: NOREF#2.18 44.96,89.35 43.31,87.69 32.26,87.69 29.84,90.11 29.84,91.88 28.57,93.15 26.54,93.15 25,91.62 LED1.3
MISO: length 49.5
  Bottom Layer w0.254: U6.1 50.42,75.37 48.89,73.85 30.1,73.85 28.7,75.25 28.7,78.47 22.1,85.07 19.97,82.94 14.02,82.94 13.84,83.12 13.84,83.17 11.94,85.07
MOSI: length 41
  Bottom Layer w0.254: U6.2 47.88,79.95 44.58,83.25 40.89,83.25 38.93,81.29 33.45,81.29 33.27,81.47 33.27,81.52 28.11,86.68 16.09,86.68 14.48,85.07
R: length 10.4
  Top Layer w0.254: NOREF.18 v1(42.67,88.84)
  Bottom Layer w0.254: v1(42.67,88.84) R2.2
SCK: length 48.9
  Top Layer w0.254: 27.18,85.07 27.18,85.03 25.27,83.12 21.51,83.12 19.56,85.07 ; v1(42.98,74.87) 42.98,59.59 U6.13
  Bottom Layer w0.254: v1(42.98,74.87) 30.48,74.87 29.59,75.76 29.59,79.06 27.18,81.47 27.18,85.07
SCL: length 40.3
  Top Layer w0.254: U3.4 16.32,52.83 17.65,54.17 17.65,56.96 18.92,58.23 22.86,58.23 24.89,60.26 26.8,60.26 29.08,62.55 33.02,62.55 34.29,63.82 34.29,69.28 40.26,75.25 U6.5
SDA: length 44
  Top Layer w0.254: U3.5 16.44,50.29 18.54,52.39 18.54,56.58 19.3,57.34 23.24,57.34 25.27,59.37 27.18,59.37 29.46,61.66 33.4,61.66 35.18,63.44 35.18,68.9 42.8,76.52 U6.4
TCS: length 28.9
  Top Layer w0.254: v1(24.25,80.45) 26.92,83.12 32,83.12 U6.6 ; v1(22.1,78.3) 17.02,83.37 17.02,85.07
  Bottom Layer w0.254: v1(24.25,80.45) v1(22.1,78.3)
$1N976: length 39.1
  Top Layer w0.56: U2.6 v1(13.33,63.91)
  Bottom Layer w0.56: SW1.3 3.4,86.84 5.46,84.77 5.46,71.79 v1(13.33,63.91)
$1N1373: length 4.9
  Top Layer w0.56: D1.2 22.38,80.12 U2.5
$1N1387: length 4
  Top Layer w0.56: U2.1 2.11,81.49 D2.2
$1N4825: length 13.1
  Bottom Layer w0.254: LED1.1 30.27,88.84 R2.1

## Copper pours and planes (outline as drawn; the poured copper is in the pictures)
GND on Top Layer: 0,94.87 52.07,94.87 52.07,0 0,0
GND on Bottom Layer: 0,94.87 52.07,94.87 52.07,0 0,0

## Text on the board
Top Silkscreen Layer: R | G | B | JLCJLCJLCJLC
